# EAGLE schematic 96_Parallelism_Yamaichi_Rev1.2 (EAGLE 9.5.2)
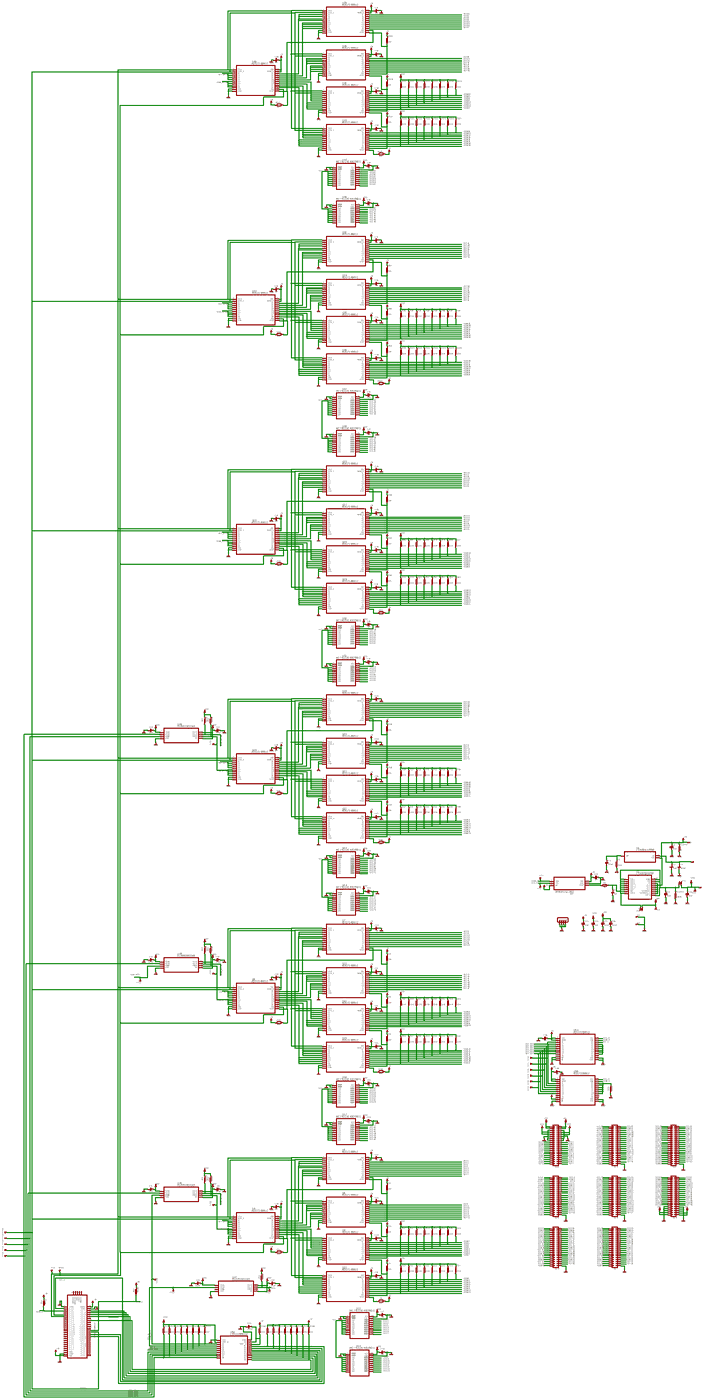
[diagram p0: schematic, sheet 1, overview]
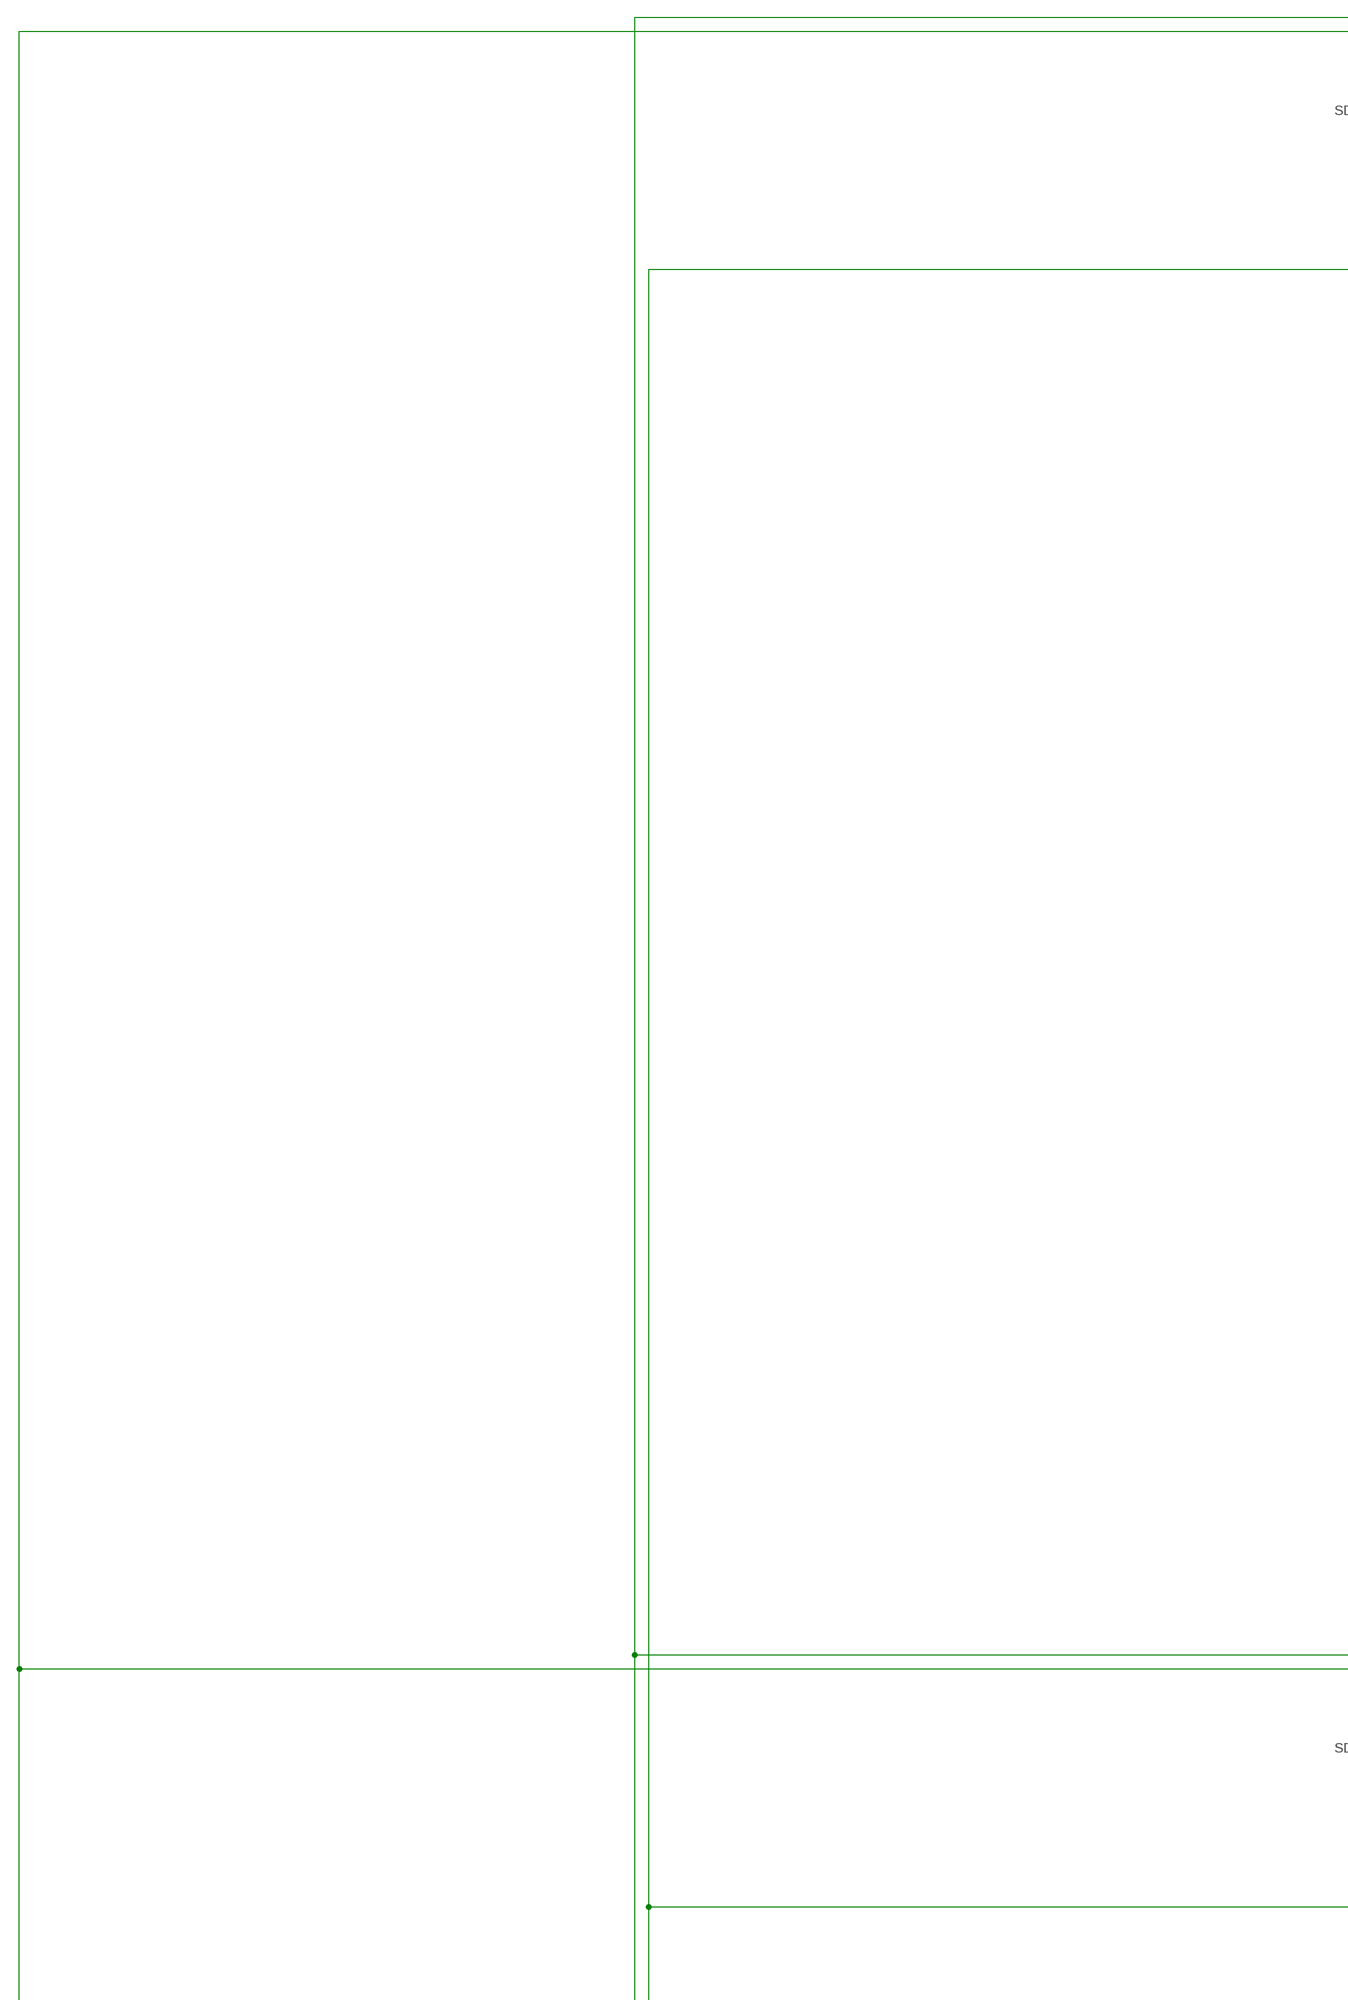
[diagram p1: schematic, sheet 1, part 1 of 8]
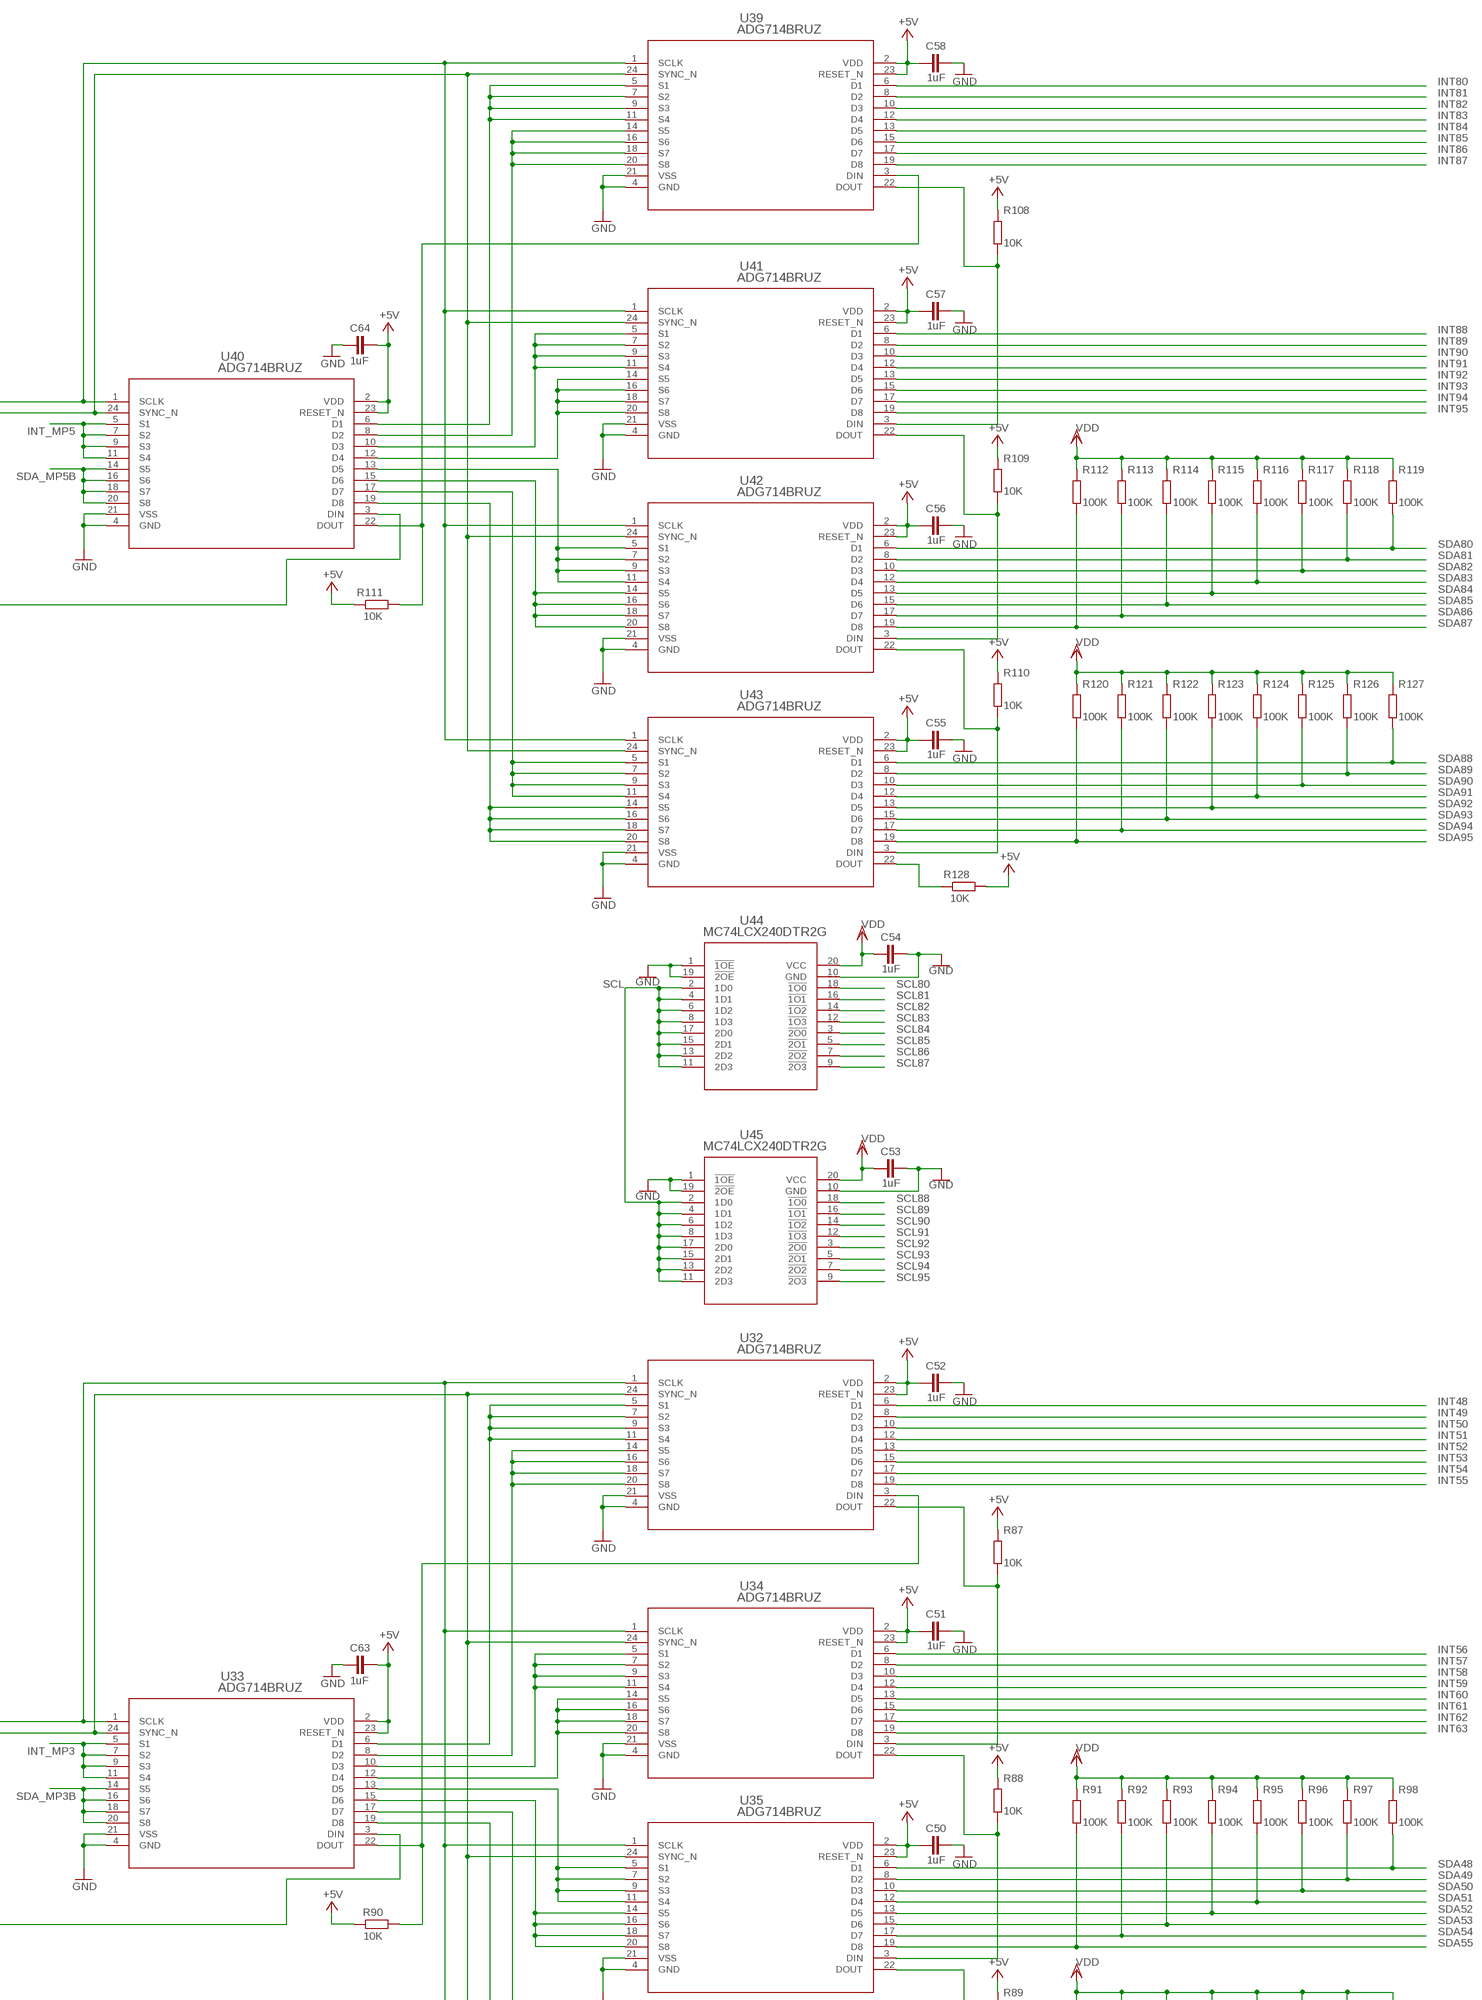
[diagram p2: schematic, sheet 1, part 2 of 8]
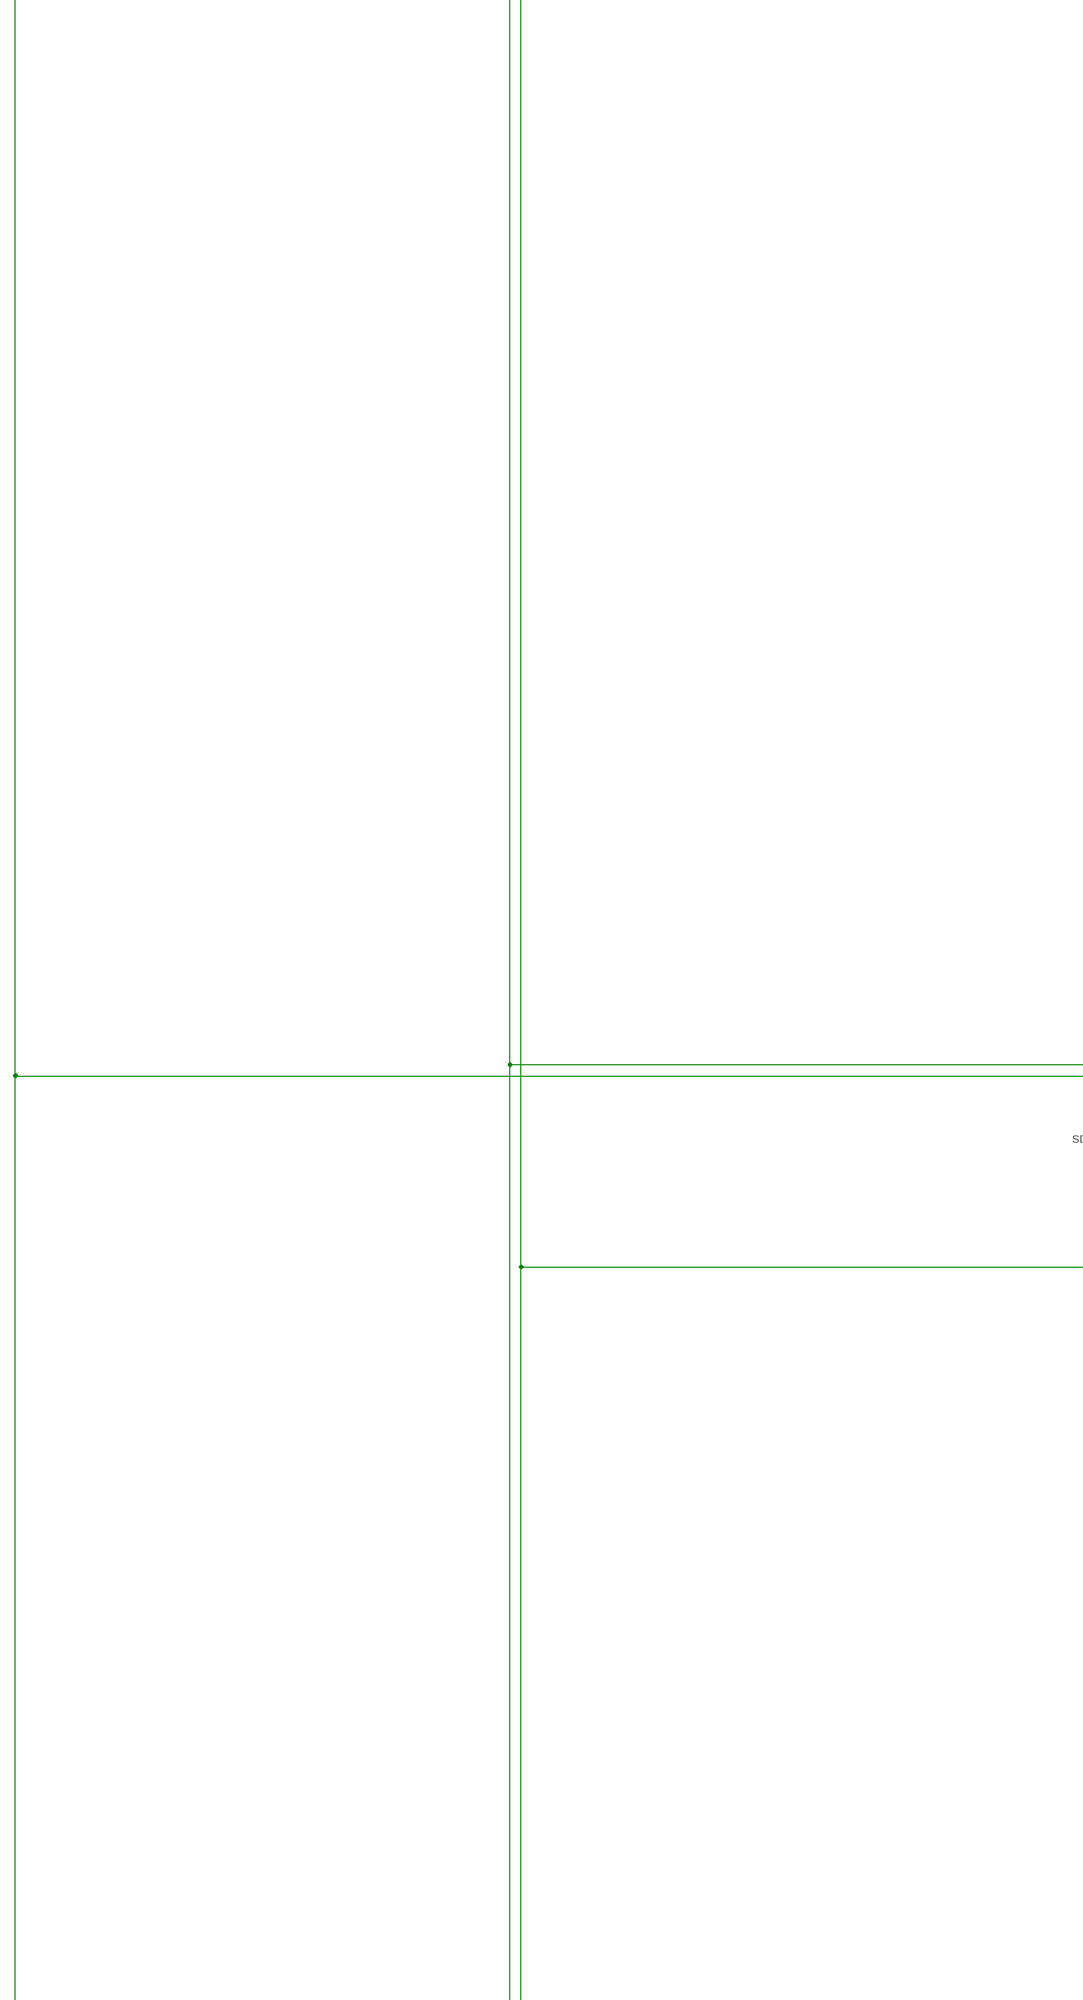
[diagram p3: schematic, sheet 1, part 3 of 8]
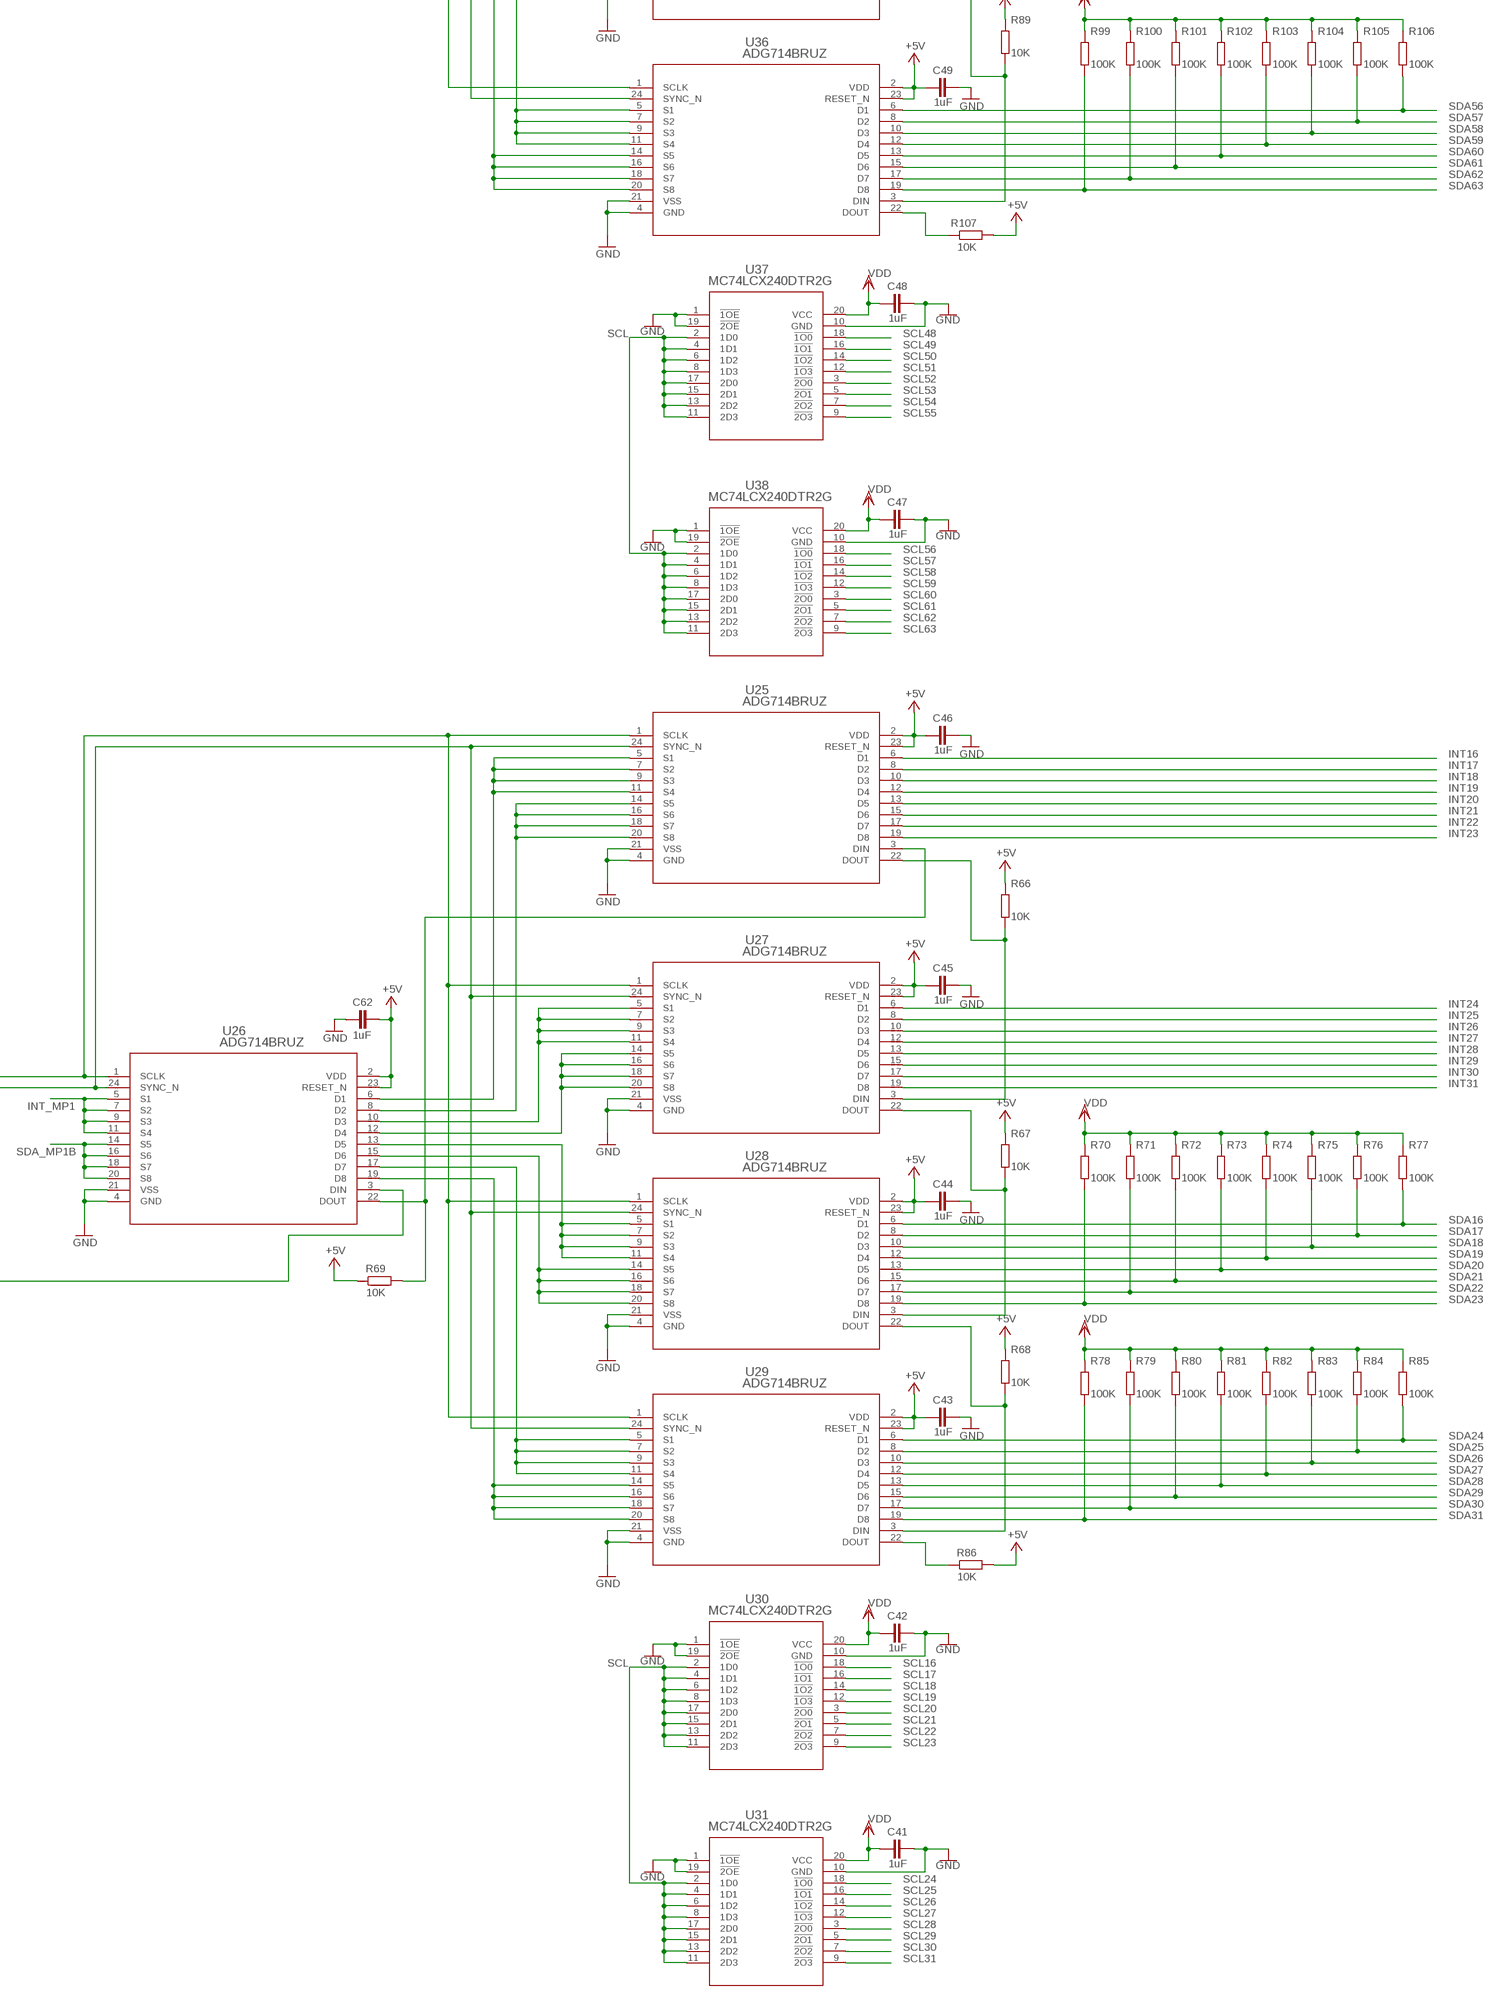
[diagram p4: schematic, sheet 1, part 4 of 8]
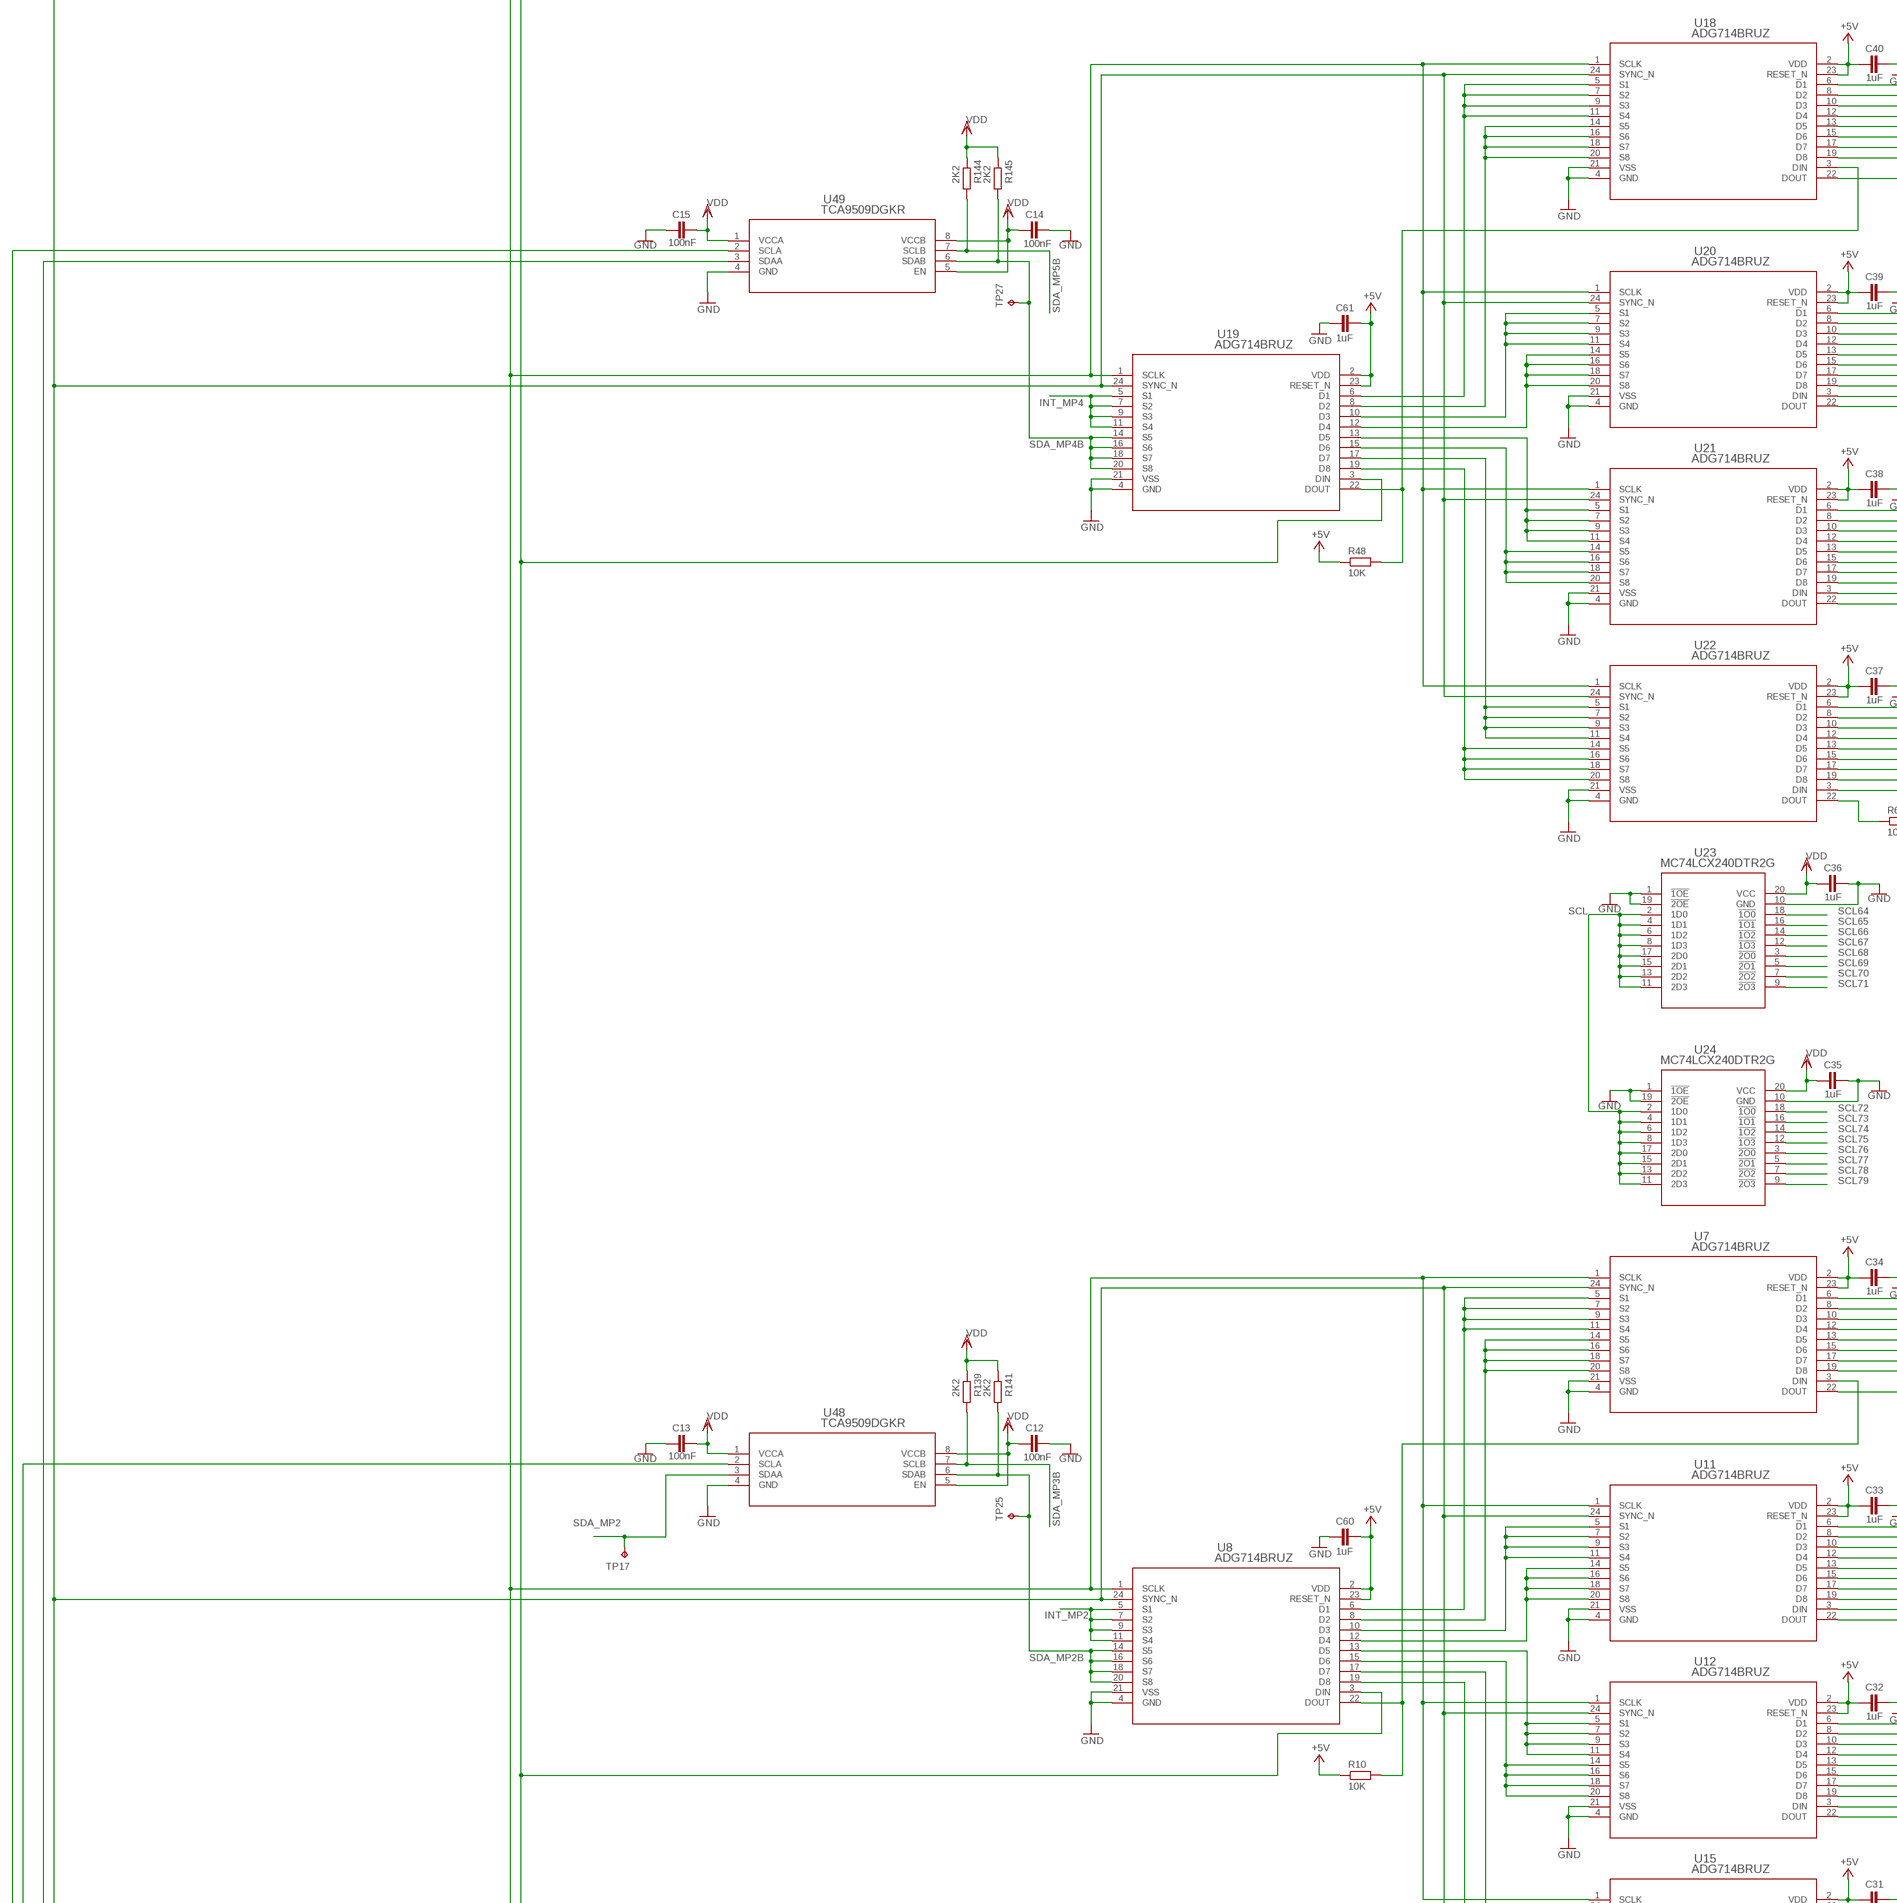
[diagram p5: schematic, sheet 1, part 5 of 8]
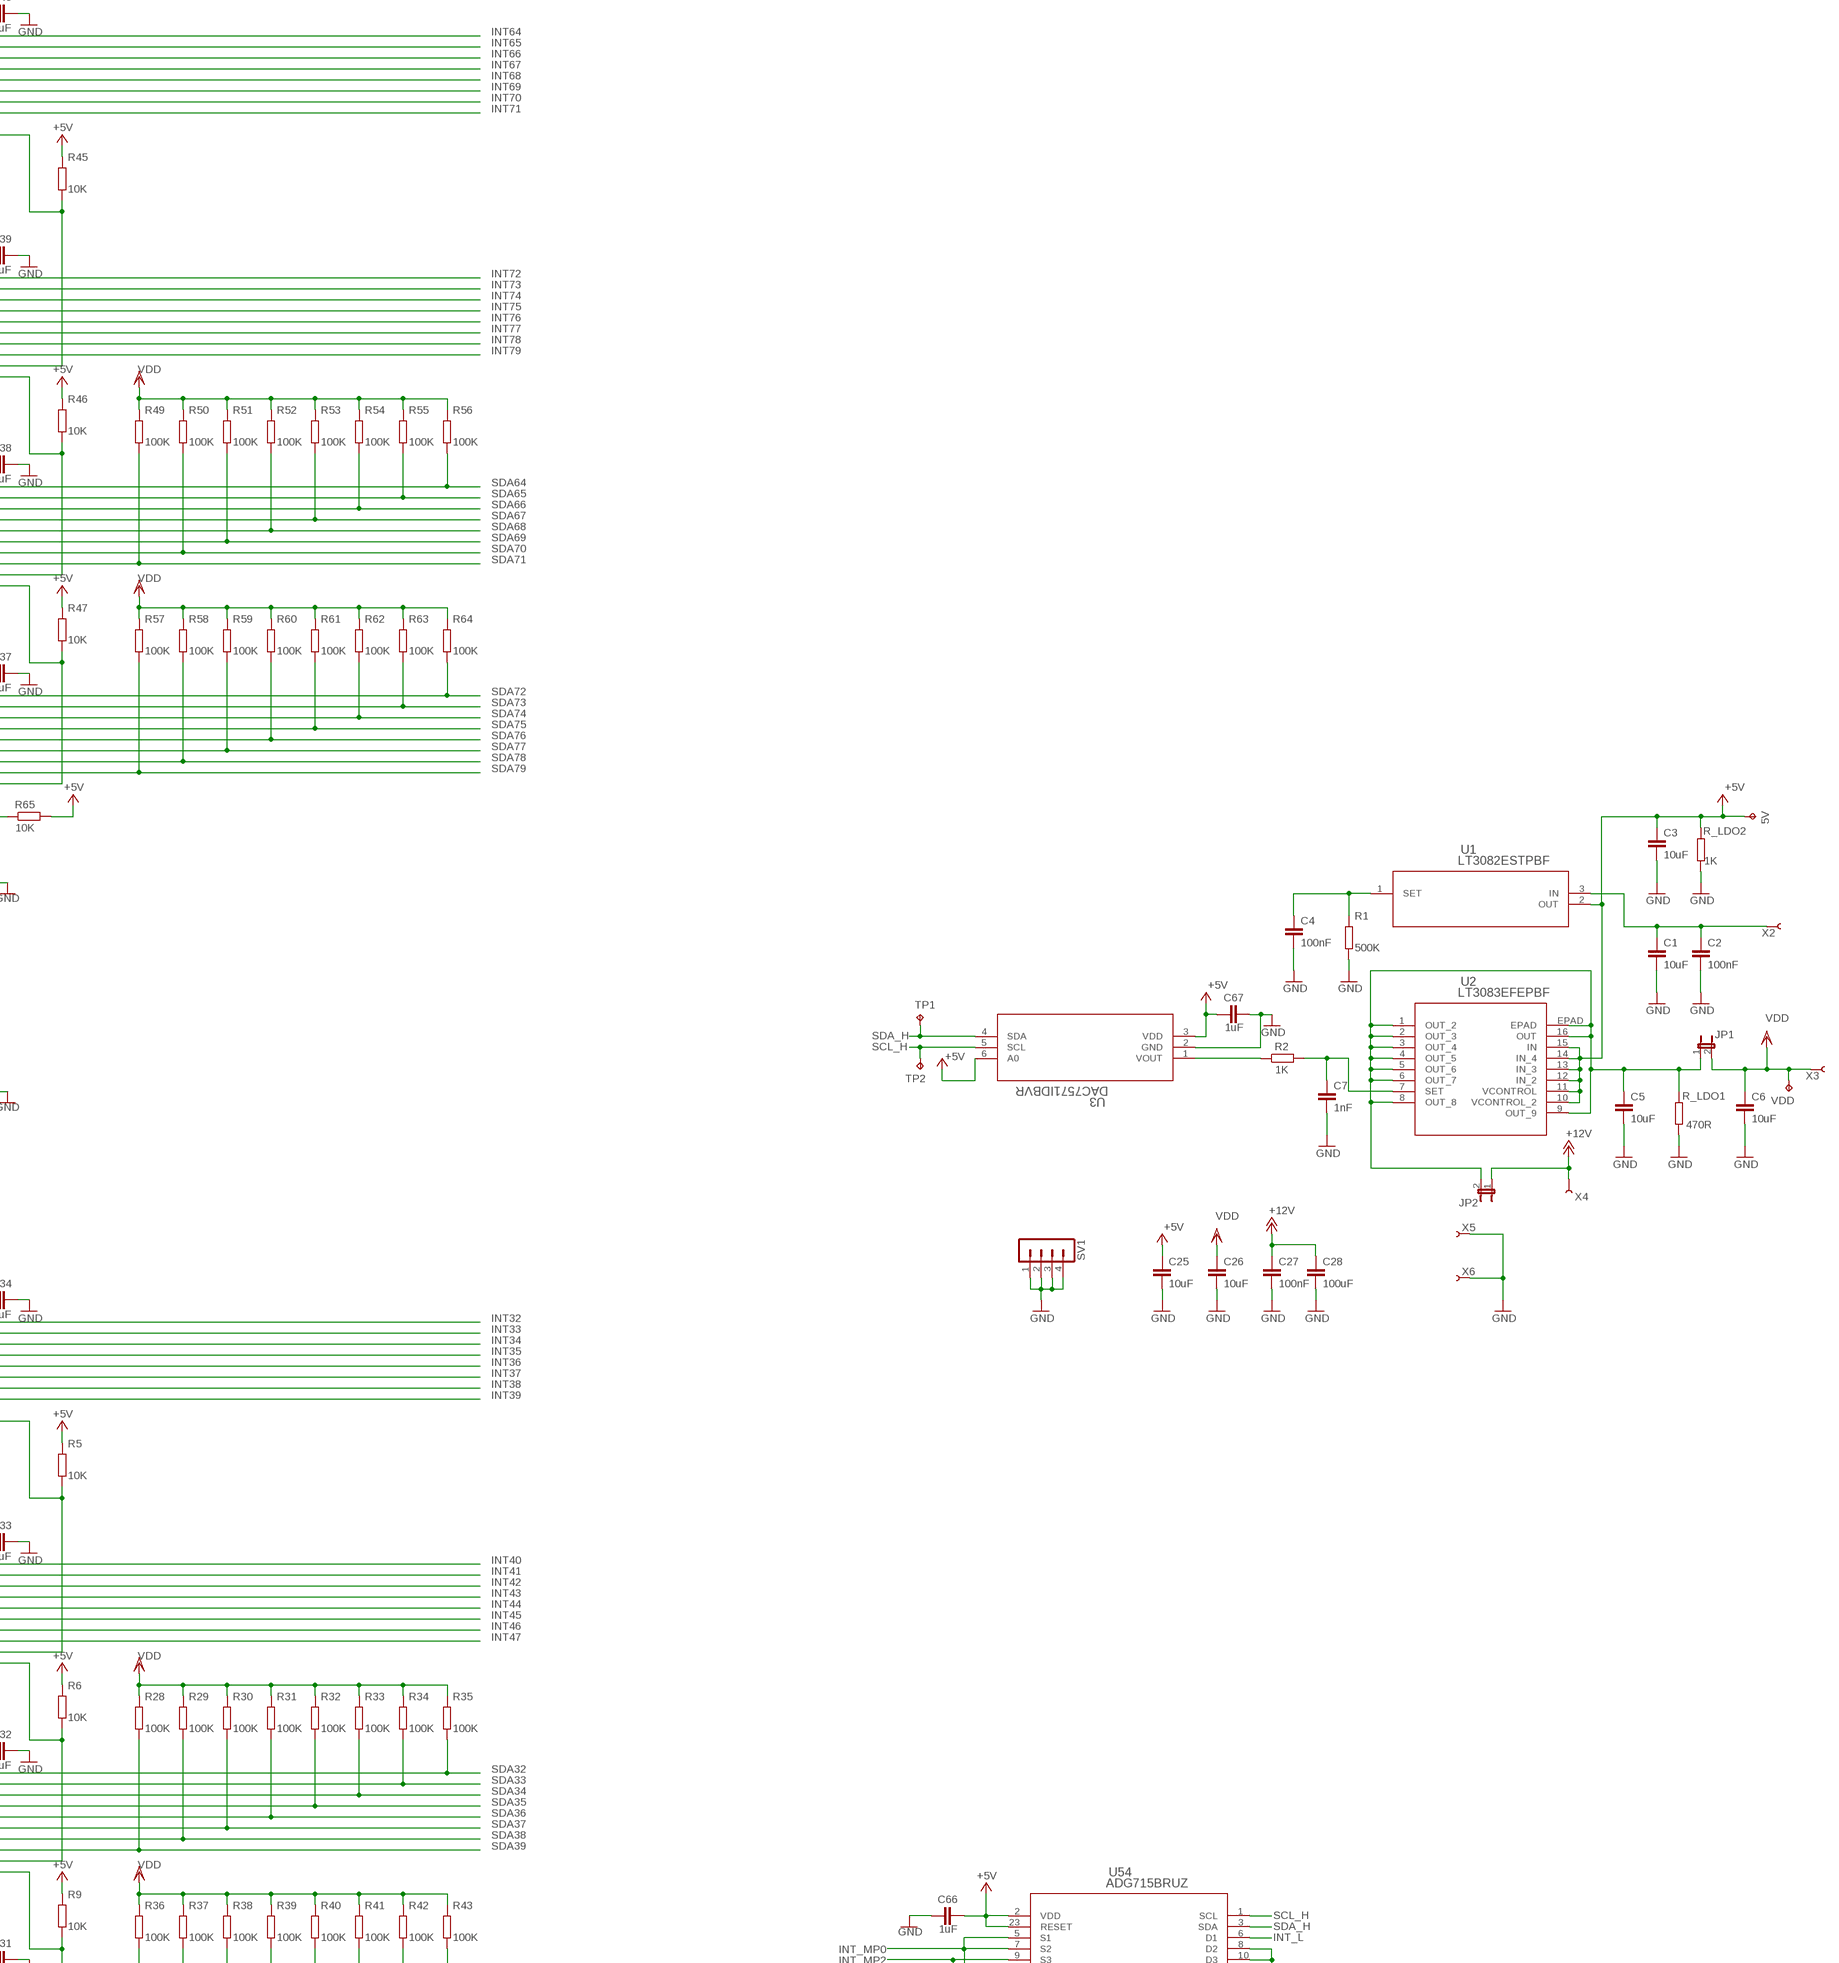
[diagram p6: schematic, sheet 1, part 6 of 8]
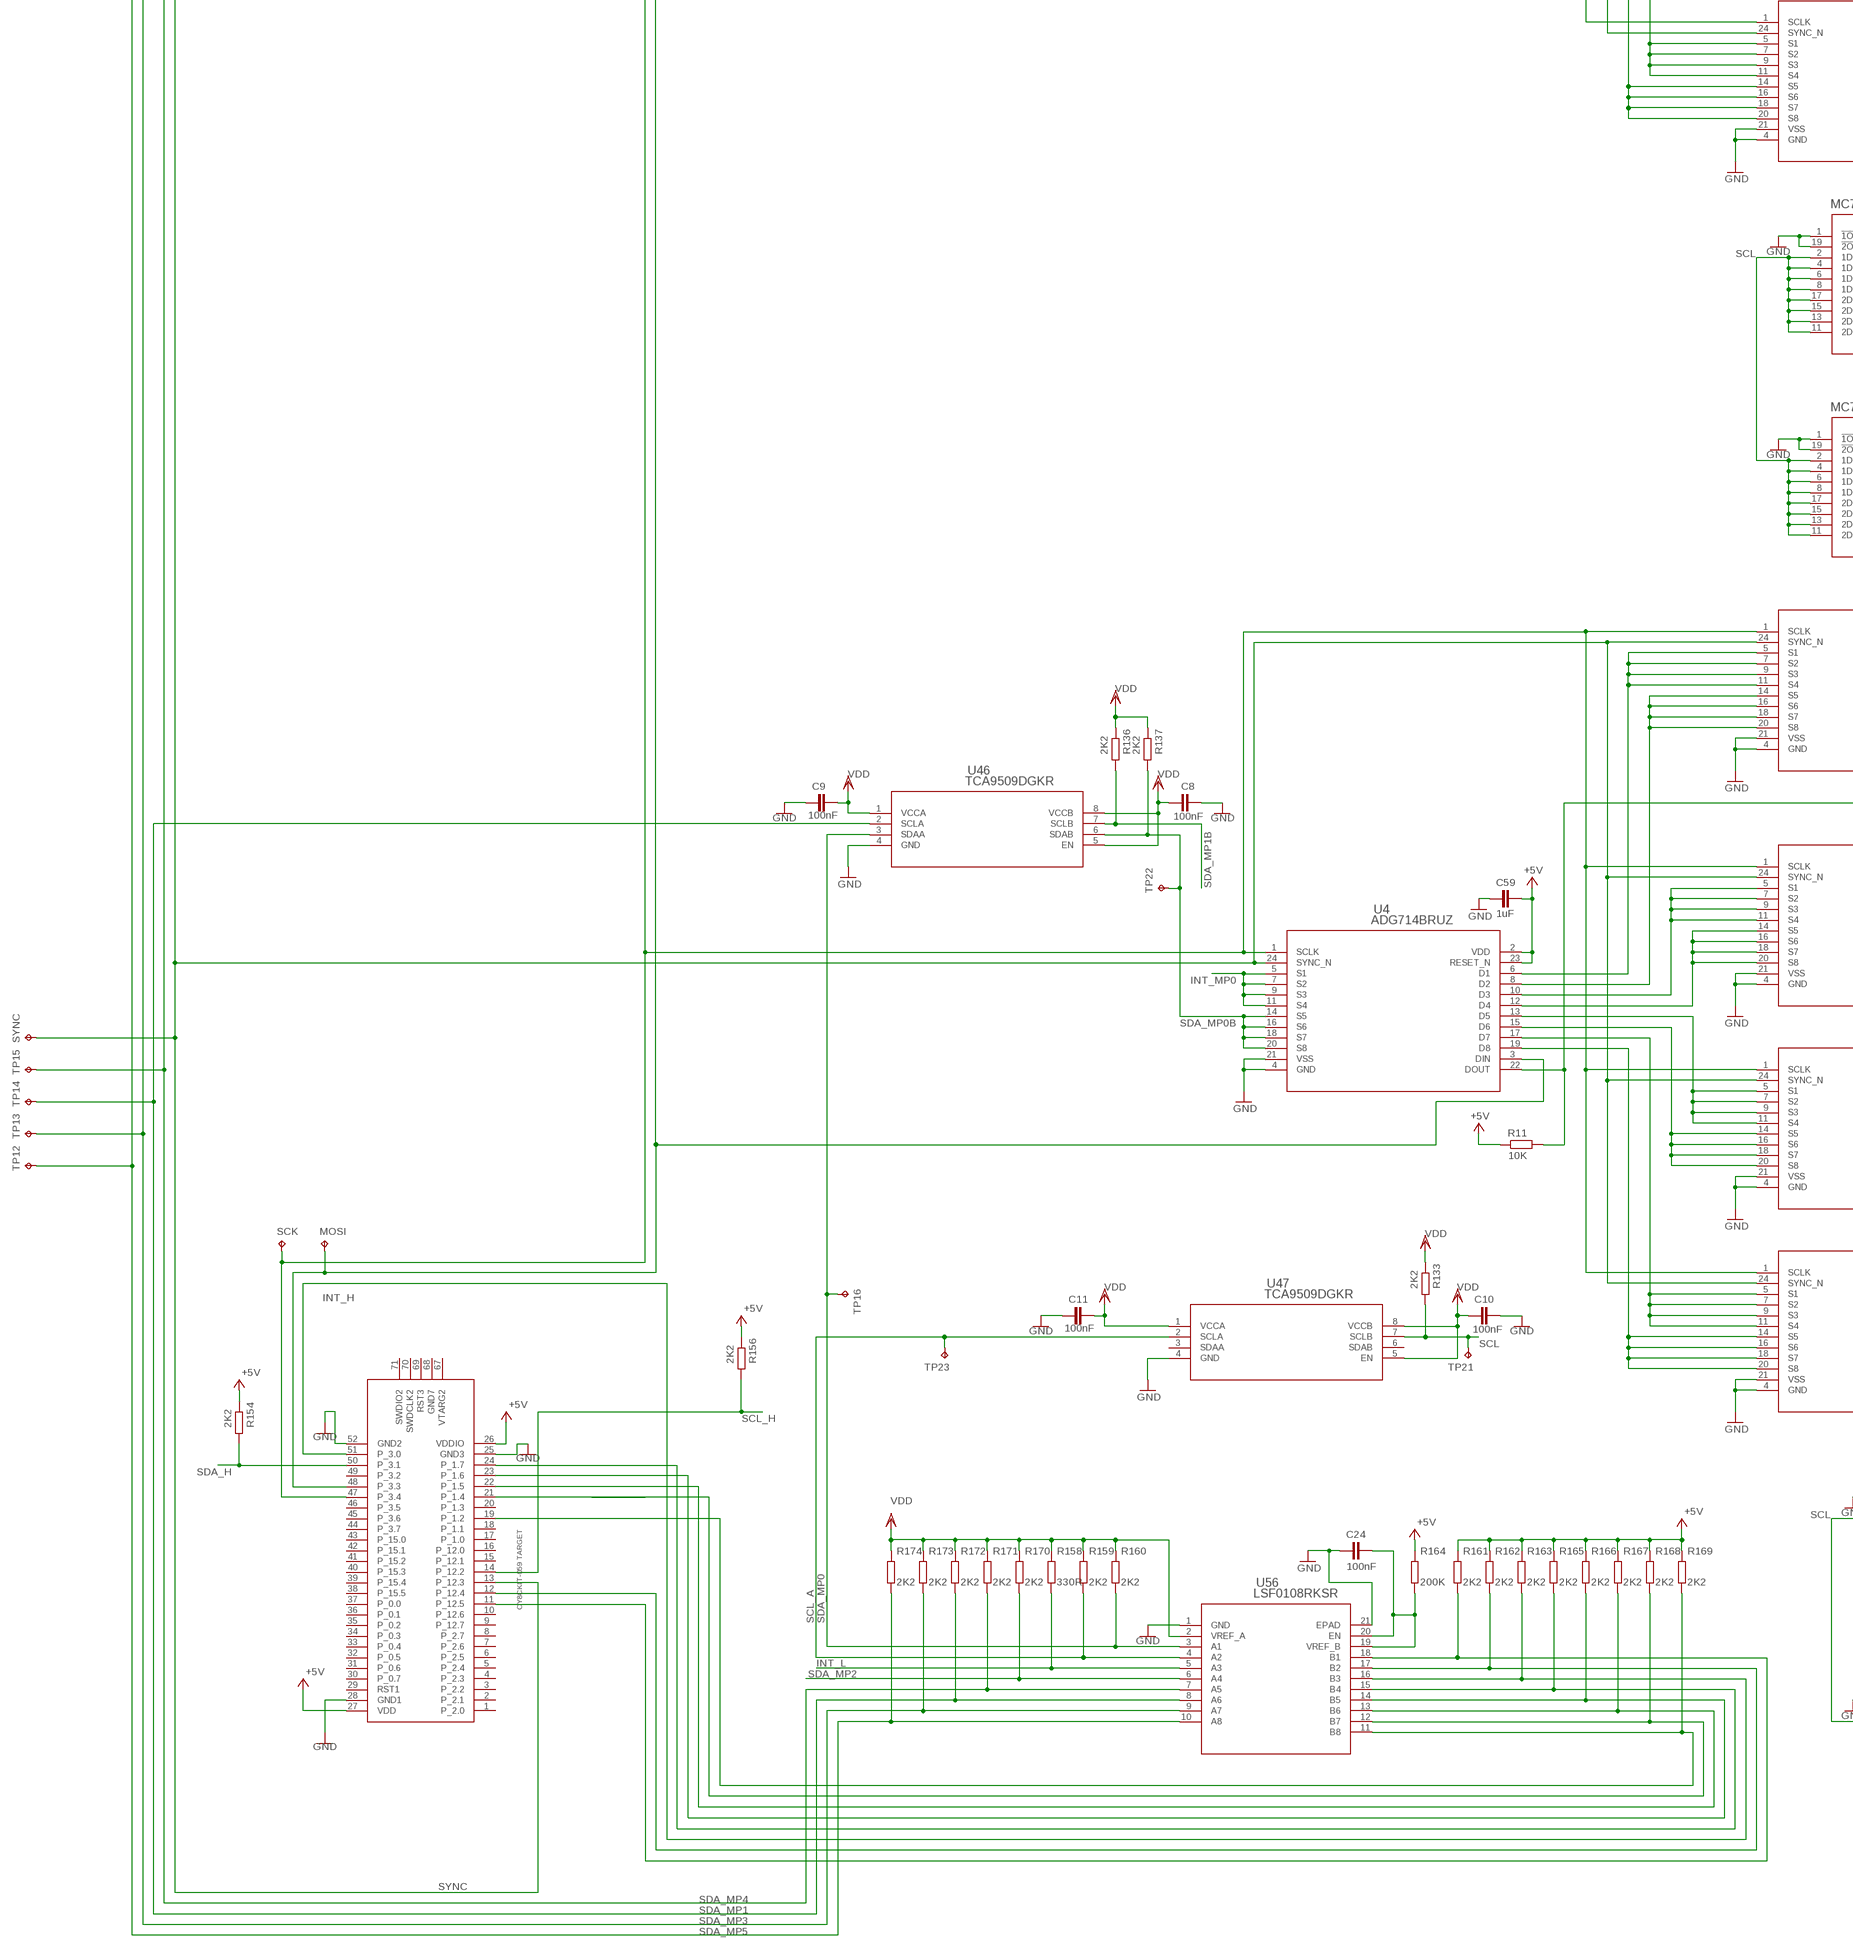
[diagram p7: schematic, sheet 1, part 7 of 8]
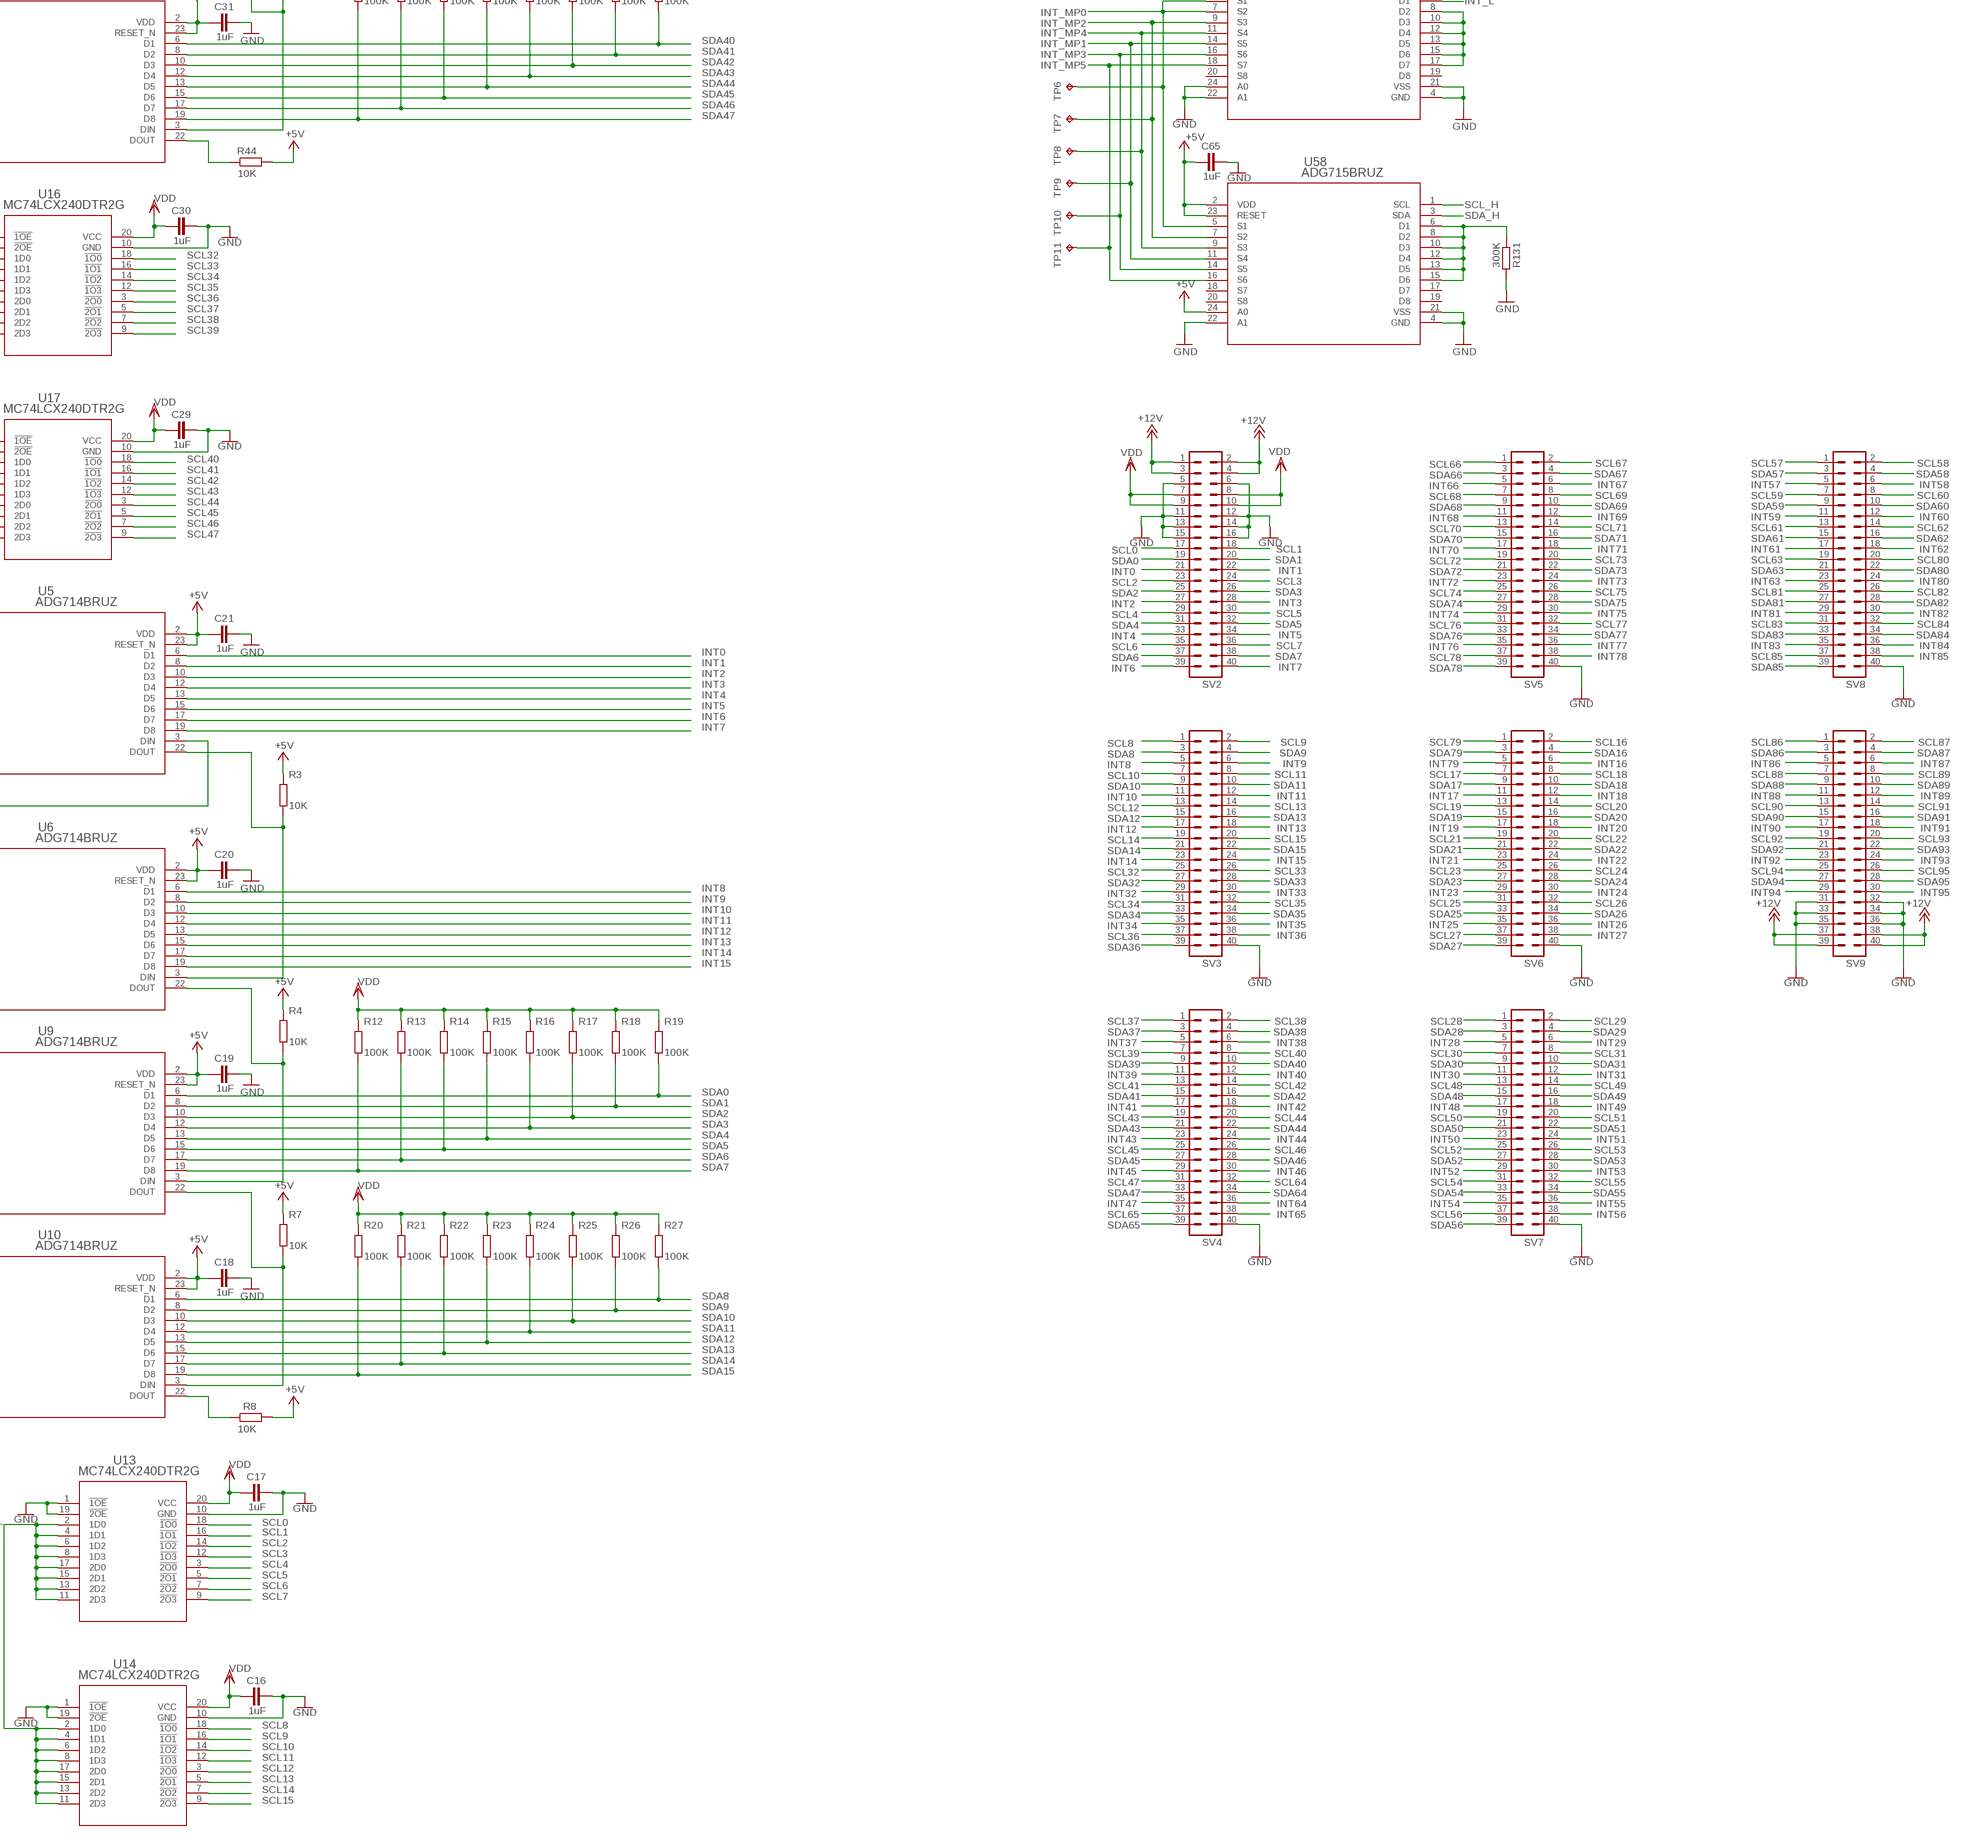
[diagram p8: schematic, sheet 1, part 8 of 8]

## Parts
5V  TPB1,27  [B1,27]
C1  10uF  C-EUC0805  [C0805]
C2  100nF  C-EUC0805  [C0805]
C3  10uF  C-EUC0805  [C0805]
C4  100nF  C-EUC0805  [C0805]
C5  10uF  C-EUC0805  [C0805]
C6  10uF  C-EUC0805  [C0805]
C7  1nF  C-EUC0805  [C0805]
C8  100nF  C-EUC0805  [C0805]
C9  100nF  C-EUC0805  [C0805]
C10  100nF  C-EUC0805  [C0805]
C11  100nF  C-EUC0805  [C0805]
C12  100nF  C-EUC0805  [C0805]
C13  100nF  C-EUC0805  [C0805]
C14  100nF  C-EUC0805  [C0805]
C15  100nF  C-EUC0805  [C0805]
C16  1uF  C-EUC0805  [C0805]
C17  1uF  C-EUC0805  [C0805]
C18  1uF  C-EUC0805  [C0805]
C19  1uF  C-EUC0805  [C0805]
C20  1uF  C-EUC0805  [C0805]
C21  1uF  C-EUC0805  [C0805]
C24  100nF  C-EUC0805  [C0805]
C25  10uF  C-EUC0805  [C0805]
C26  10uF  C-EUC0805  [C0805]
C27  100nF  C-EUC0805  [C0805]
C28  100uF  C-EUC1210  [C1210]
C29  1uF  C-EUC0805  [C0805]
C30  1uF  C-EUC0805  [C0805]
C31  1uF  C-EUC0805  [C0805]
C32  1uF  C-EUC0805  [C0805]
C33  1uF  C-EUC0805  [C0805]
C34  1uF  C-EUC0805  [C0805]
C35  1uF  C-EUC0805  [C0805]
C36  1uF  C-EUC0805  [C0805]
C37  1uF  C-EUC0805  [C0805]
C38  1uF  C-EUC0805  [C0805]
C39  1uF  C-EUC0805  [C0805]
C40  1uF  C-EUC0805  [C0805]
C41  1uF  C-EUC0805  [C0805]
C42  1uF  C-EUC0805  [C0805]
C43  1uF  C-EUC0805  [C0805]
C44  1uF  C-EUC0805  [C0805]
C45  1uF  C-EUC0805  [C0805]
C46  1uF  C-EUC0805  [C0805]
C47  1uF  C-EUC0805  [C0805]
C48  1uF  C-EUC0805  [C0805]
C49  1uF  C-EUC0805  [C0805]
C50  1uF  C-EUC0805  [C0805]
C51  1uF  C-EUC0805  [C0805]
C52  1uF  C-EUC0805  [C0805]
C53  1uF  C-EUC0805  [C0805]
C54  1uF  C-EUC0805  [C0805]
C55  1uF  C-EUC0805  [C0805]
C56  1uF  C-EUC0805  [C0805]
C57  1uF  C-EUC0805  [C0805]
C58  1uF  C-EUC0805  [C0805]
C59  1uF  C-EUC0805  [C0805]
C60  1uF  C-EUC0805  [C0805]
C61  1uF  C-EUC0805  [C0805]
C62  1uF  C-EUC0805  [C0805]
C63  1uF  C-EUC0805  [C0805]
C64  1uF  C-EUC0805  [C0805]
C65  1uF  C-EUC0805  [C0805]
C66  1uF  C-EUC0805  [C0805]
C67  1uF  C-EUC0805  [C0805]
JP1  JP1E  [JP1]
JP2  JP1E  [JP1]
MOSI  TPB1,27  [B1,27]
R1  500K  R-EU_R0805  [R0805]
R2  1K  R-EU_R0805  [R0805]
R3  10K  R-EU_R0805  [R0805]
R4  10K  R-EU_R0805  [R0805]
R5  10K  R-EU_R0805  [R0805]
R6  10K  R-EU_R0805  [R0805]
R7  10K  R-EU_R0805  [R0805]
R8  10K  R-EU_R0805  [R0805]
R9  10K  R-EU_R0805  [R0805]
R10  10K  R-EU_R0805  [R0805]
R11  10K  R-EU_R0805  [R0805]
R12  100K  R-EU_R0805  [R0805]
R13  100K  R-EU_R0805  [R0805]
R14  100K  R-EU_R0805  [R0805]
R15  100K  R-EU_R0805  [R0805]
R16  100K  R-EU_R0805  [R0805]
R17  100K  R-EU_R0805  [R0805]
R18  100K  R-EU_R0805  [R0805]
R19  100K  R-EU_R0805  [R0805]
R20  100K  R-EU_R0805  [R0805]
R21  100K  R-EU_R0805  [R0805]
R22  100K  R-EU_R0805  [R0805]
R23  100K  R-EU_R0805  [R0805]
R24  100K  R-EU_R0805  [R0805]
R25  100K  R-EU_R0805  [R0805]
R26  100K  R-EU_R0805  [R0805]
R27  100K  R-EU_R0805  [R0805]
R28  100K  R-EU_R0805  [R0805]
R29  100K  R-EU_R0805  [R0805]
R30  100K  R-EU_R0805  [R0805]
R31  100K  R-EU_R0805  [R0805]
R32  100K  R-EU_R0805  [R0805]
R33  100K  R-EU_R0805  [R0805]
R34  100K  R-EU_R0805  [R0805]
R35  100K  R-EU_R0805  [R0805]
R36  100K  R-EU_R0805  [R0805]
R37  100K  R-EU_R0805  [R0805]
R38  100K  R-EU_R0805  [R0805]
R39  100K  R-EU_R0805  [R0805]
R40  100K  R-EU_R0805  [R0805]
R41  100K  R-EU_R0805  [R0805]
R42  100K  R-EU_R0805  [R0805]
R43  100K  R-EU_R0805  [R0805]
R44  10K  R-EU_R0805  [R0805]
R45  10K  R-EU_R0805  [R0805]
R46  10K  R-EU_R0805  [R0805]
R47  10K  R-EU_R0805  [R0805]
R48  10K  R-EU_R0805  [R0805]
R49  100K  R-EU_R0805  [R0805]
R50  100K  R-EU_R0805  [R0805]
R51  100K  R-EU_R0805  [R0805]
R52  100K  R-EU_R0805  [R0805]
R53  100K  R-EU_R0805  [R0805]
R54  100K  R-EU_R0805  [R0805]
R55  100K  R-EU_R0805  [R0805]
R56  100K  R-EU_R0805  [R0805]
R57  100K  R-EU_R0805  [R0805]
R58  100K  R-EU_R0805  [R0805]
R59  100K  R-EU_R0805  [R0805]
R60  100K  R-EU_R0805  [R0805]
R61  100K  R-EU_R0805  [R0805]
R62  100K  R-EU_R0805  [R0805]
R63  100K  R-EU_R0805  [R0805]
R64  100K  R-EU_R0805  [R0805]
R65  10K  R-EU_R0805  [R0805]
R66  10K  R-EU_R0805  [R0805]
R67  10K  R-EU_R0805  [R0805]
R68  10K  R-EU_R0805  [R0805]
R69  10K  R-EU_R0805  [R0805]
R70  100K  R-EU_R0805  [R0805]
R71  100K  R-EU_R0805  [R0805]
R72  100K  R-EU_R0805  [R0805]
R73  100K  R-EU_R0805  [R0805]
R74  100K  R-EU_R0805  [R0805]
R75  100K  R-EU_R0805  [R0805]
R76  100K  R-EU_R0805  [R0805]
R77  100K  R-EU_R0805  [R0805]
R78  100K  R-EU_R0805  [R0805]
R79  100K  R-EU_R0805  [R0805]
R80  100K  R-EU_R0805  [R0805]
R81  100K  R-EU_R0805  [R0805]
R82  100K  R-EU_R0805  [R0805]
R83  100K  R-EU_R0805  [R0805]
R84  100K  R-EU_R0805  [R0805]
R85  100K  R-EU_R0805  [R0805]
R86  10K  R-EU_R0805  [R0805]
R87  10K  R-EU_R0805  [R0805]
R88  10K  R-EU_R0805  [R0805]
R89  10K  R-EU_R0805  [R0805]
R90  10K  R-EU_R0805  [R0805]
R91  100K  R-EU_R0805  [R0805]
R92  100K  R-EU_R0805  [R0805]
R93  100K  R-EU_R0805  [R0805]
R94  100K  R-EU_R0805  [R0805]
R95  100K  R-EU_R0805  [R0805]
R96  100K  R-EU_R0805  [R0805]
R97  100K  R-EU_R0805  [R0805]
R98  100K  R-EU_R0805  [R0805]
R99  100K  R-EU_R0805  [R0805]
R100  100K  R-EU_R0805  [R0805]
R101  100K  R-EU_R0805  [R0805]
R102  100K  R-EU_R0805  [R0805]
R103  100K  R-EU_R0805  [R0805]
R104  100K  R-EU_R0805  [R0805]
R105  100K  R-EU_R0805  [R0805]
R106  100K  R-EU_R0805  [R0805]
R107  10K  R-EU_R0805  [R0805]
R108  10K  R-EU_R0805  [R0805]
R109  10K  R-EU_R0805  [R0805]
R110  10K  R-EU_R0805  [R0805]
R111  10K  R-EU_R0805  [R0805]
R112  100K  R-EU_R0805  [R0805]
R113  100K  R-EU_R0805  [R0805]
R114  100K  R-EU_R0805  [R0805]
R115  100K  R-EU_R0805  [R0805]
R116  100K  R-EU_R0805  [R0805]
R117  100K  R-EU_R0805  [R0805]
R118  100K  R-EU_R0805  [R0805]
R119  100K  R-EU_R0805  [R0805]
R120  100K  R-EU_R0805  [R0805]
R121  100K  R-EU_R0805  [R0805]
R122  100K  R-EU_R0805  [R0805]
R123  100K  R-EU_R0805  [R0805]
R124  100K  R-EU_R0805  [R0805]
R125  100K  R-EU_R0805  [R0805]
R126  100K  R-EU_R0805  [R0805]
R127  100K  R-EU_R0805  [R0805]
R128  10K  R-EU_R0805  [R0805]
R131  300K  R-EU_R0805  [R0805]
R133  2K2  R-EU_R0805  [R0805]
R136  2K2  R-EU_R0805  [R0805]
R137  2K2  R-EU_R0805  [R0805]
R139  2K2  R-EU_R0805  [R0805]
R141  2K2  R-EU_R0805  [R0805]
R144  2K2  R-EU_R0805  [R0805]
R145  2K2  R-EU_R0805  [R0805]
R154  2K2  R-EU_R0805  [R0805]
R156  2K2  R-EU_R0805  [R0805]
R158  330R  R-EU_R0805  [R0805]
R159  2K2  R-EU_R0805  [R0805]
R160  2K2  R-EU_R0805  [R0805]
R161  2K2  R-EU_R0805  [R0805]
R162  2K2  R-EU_R0805  [R0805]
R163  2K2  R-EU_R0805  [R0805]
R164  200K  R-EU_R0805  [R0805]
R165  2K2  R-EU_R0805  [R0805]
R166  2K2  R-EU_R0805  [R0805]
R167  2K2  R-EU_R0805  [R0805]
R168  2K2  R-EU_R0805  [R0805]
R169  2K2  R-EU_R0805  [R0805]
R170  2K2  R-EU_R0805  [R0805]
R171  2K2  R-EU_R0805  [R0805]
R172  2K2  R-EU_R0805  [R0805]
R173  2K2  R-EU_R0805  [R0805]
R174  2K2  R-EU_R0805  [R0805]
R_LDO1  470R  R-EU_R0805  [R0805]
R_LDO2  1K  R-EU_R0805  [R0805]
SCK  TPB1,27  [B1,27]
SV1  MA04-1  [MA04-1]
SV2  MA20-2  [MA20-2]
SV3  MA20-2  [MA20-2]
SV4  MA20-2  [MA20-2]
SV5  MA20-2  [MA20-2]
SV6  MA20-2  [MA20-2]
SV7  MA20-2  [MA20-2]
SV8  MA20-2  [MA20-2]
SV9  MA20-2  [MA20-2]
SYNC  TPB1,27  [B1,27]
TP1  TPB1,27  [B1,27]
TP2  TPB1,27  [B1,27]
TP6  TPB1,27  [B1,27]
TP7  TPB1,27  [B1,27]
TP8  TPB1,27  [B1,27]
TP9  TPB1,27  [B1,27]
TP10  TPB1,27  [B1,27]
TP11  TPB1,27  [B1,27]
TP12  TPB1,27  [B1,27]
TP13  TPB1,27  [B1,27]
TP14  TPB1,27  [B1,27]
TP15  TPB1,27  [B1,27]
TP16  TPB1,27  [B1,27]
TP17  TPB1,27  [B1,27]
TP21  TPB1,27  [B1,27]
TP22  TPB1,27  [B1,27]
TP23  TPB1,27  [B1,27]
TP25  TPB1,27  [B1,27]
TP27  TPB1,27  [B1,27]
U1  LT3082ESTPBF  [SOT-223_ST_LIT]
U2  LT3083EFEPBF  [TSSOP-16_FE/BB_LIT]
U3  DAC7571IDBVR  [DBV6]
U4  ADG714BRUZ  [RU_24_ADI]
U5  ADG714BRUZ  [RU_24_ADI]
U6  ADG714BRUZ  [RU_24_ADI]
U7  ADG714BRUZ  [RU_24_ADI]
U8  ADG714BRUZ  [RU_24_ADI]
U9  ADG714BRUZ  [RU_24_ADI]
U10  ADG714BRUZ  [RU_24_ADI]
U11  ADG714BRUZ  [RU_24_ADI]
U12  ADG714BRUZ  [RU_24_ADI]
U13  MC74LCX240DTR2G  [TSSOP20_4P50X6P60_ONS]
U14  MC74LCX240DTR2G  [TSSOP20_4P50X6P60_ONS]
U15  ADG714BRUZ  [RU_24_ADI]
U16  MC74LCX240DTR2G  [TSSOP20_4P50X6P60_ONS]
U17  MC74LCX240DTR2G  [TSSOP20_4P50X6P60_ONS]
U18  ADG714BRUZ  [RU_24_ADI]
U19  ADG714BRUZ  [RU_24_ADI]
U20  ADG714BRUZ  [RU_24_ADI]
U21  ADG714BRUZ  [RU_24_ADI]
U22  ADG714BRUZ  [RU_24_ADI]
U23  MC74LCX240DTR2G  [TSSOP20_4P50X6P60_ONS]
U24  MC74LCX240DTR2G  [TSSOP20_4P50X6P60_ONS]
U25  ADG714BRUZ  [RU_24_ADI]
U26  ADG714BRUZ  [RU_24_ADI]
U27  ADG714BRUZ  [RU_24_ADI]
U28  ADG714BRUZ  [RU_24_ADI]
U29  ADG714BRUZ  [RU_24_ADI]
U30  MC74LCX240DTR2G  [TSSOP20_4P50X6P60_ONS]
U31  MC74LCX240DTR2G  [TSSOP20_4P50X6P60_ONS]
U32  ADG714BRUZ  [RU_24_ADI]
U33  ADG714BRUZ  [RU_24_ADI]
U34  ADG714BRUZ  [RU_24_ADI]
U35  ADG714BRUZ  [RU_24_ADI]
U36  ADG714BRUZ  [RU_24_ADI]
U37  MC74LCX240DTR2G  [TSSOP20_4P50X6P60_ONS]
U38  MC74LCX240DTR2G  [TSSOP20_4P50X6P60_ONS]
U39  ADG714BRUZ  [RU_24_ADI]
U40  ADG714BRUZ  [RU_24_ADI]
U41  ADG714BRUZ  [RU_24_ADI]
U42  ADG714BRUZ  [RU_24_ADI]
U43  ADG714BRUZ  [RU_24_ADI]
U44  MC74LCX240DTR2G  [TSSOP20_4P50X6P60_ONS]
U45  MC74LCX240DTR2G  [TSSOP20_4P50X6P60_ONS]
U46  TCA9509DGKR  [DGK8]
U47  TCA9509DGKR  [DGK8]
U48  TCA9509DGKR  [DGK8]
U49  TCA9509DGKR  [DGK8]
U54  ADG715BRUZ  [RU_24_ADI]
U56  LSF0108RKSR  [RKS20_1P1X3P1_TEX]
U58  ADG715BRUZ  [RU_24_ADI]
U$1  CY8CKIT-059_TARGET  [CY8CKIT-059_TARGET]
VDD  TPB1,27  [B1,27]
X2  MPB2M  [MPB2M]
X3  MPB2M  [MPB2M]
X4  MPB2M  [MPB2M]
X5  MPB2M  [MPB2M]
X6  MPB2M  [MPB2M]

## Nets
+5V: 5V.TP C3.1 C18.1 C19.1 C20.1 C21.1 C25.1 C31.1 C32.1 C33.1 C34.1 C37.1 C38.1 C39.1 C40.1 C43.1 C44.1 C45.1 C46.1 C49.1 C50.1 C51.1 C52.1 C55.1 C56.1 C57.1 C58.1 C59.1 C60.1 C61.1 C62.1 C63.1 C64.1 C65.1 C66.1 C67.2 R3.1 R4.1 R5.1 R6.1 R7.1 R8.2 R9.1 R10.1 R11.1 R44.2 R45.1 R46.1 R47.1 R48.1 R65.2 R66.1 R67.1 R68.1 R69.1 R86.2 R87.1 R88.1 R89.1 R90.1 R107.2 R108.1 R109.1 R110.1 R111.1 R128.2 R154.1 R156.1 R161.1 R162.1 R163.1 R164.1 R165.1 R166.1 R167.1 R168.1 R169.1 R_LDO2.1 U1.2(OUT) U2.10(VCONTROL_2) U2.11(VCONTROL) U2.12(IN_2) U2.13(IN_3) U2.14(IN_4) U2.15(IN) U3.3(VDD) U3.6(A0) U4.2(VDD) U4.23(RESET_N) U5.2(VDD) U5.23(RESET_N) U6.2(VDD) U6.23(RESET_N) U7.2(VDD) U7.23(RESET_N) U8.2(VDD) U8.23(RESET_N) U9.2(VDD) U9.23(RESET_N) U10.2(VDD) U10.23(RESET_N) U11.2(VDD) U11.23(RESET_N) U12.2(VDD) U12.23(RESET_N) U15.2(VDD) U15.23(RESET_N) U18.2(VDD) U18.23(RESET_N) U19.2(VDD) U19.23(RESET_N) U20.2(VDD) U20.23(RESET_N) U21.2(VDD) U21.23(RESET_N) U22.2(VDD) U22.23(RESET_N) U25.2(VDD) U25.23(RESET_N) U26.2(VDD) U26.23(RESET_N) U27.2(VDD) U27.23(RESET_N) U28.2(VDD) U28.23(RESET_N) U29.2(VDD) U29.23(RESET_N) U32.2(VDD) U32.23(RESET_N) U33.2(VDD) U33.23(RESET_N) U34.2(VDD) U34.23(RESET_N) U35.2(VDD) U35.23(RESET_N) U36.2(VDD) U36.23(RESET_N) U39.2(VDD) U39.23(RESET_N) U40.2(VDD) U40.23(RESET_N) U41.2(VDD) U41.23(RESET_N) U42.2(VDD) U42.23(RESET_N) U43.2(VDD) U43.23(RESET_N) U54.2(VDD) U54.23(RESET) U58.2(VDD) U58.23(RESET) U58.24(A0) U$1.26(VDDIO) U$1.27(VDD)
+12V: C27.1 C28.1 JP2.1 SV2.1 SV2.2 SV2.3 SV2.4 SV9.37 SV9.38 SV9.39 SV9.40 X4.1 X4.1@1
GND: C1.2 C2.2 C3.2 C4.2 C5.2 C6.2 C7.2 C8.2 C9.2 C10.2 C11.2 C12.2 C13.2 C14.2 C15.2 C16.2 C17.2 C18.2 C19.2 C20.2 C21.2 C24.1 C25.2 C26.2 C27.2 C28.2 C29.2 C30.2 C31.2 C32.2 C33.2 C34.2 C35.2 C36.2 C37.2 C38.2 C39.2 C40.2 C41.2 C42.2 C43.2 C44.2 C45.2 C46.2 C47.2 C48.2 C49.2 C50.2 C51.2 C52.2 C53.2 C54.2 C55.2 C56.2 C57.2 C58.2 C59.2 C60.2 C61.2 C62.2 C63.2 C64.2 C65.2 C66.2 C67.1 R1.2 R131.1 R_LDO1.2 R_LDO2.2 SV1.1 SV1.2 SV1.3 SV1.4 SV2.5 SV2.6 SV2.11 SV2.12 SV2.13 SV2.14 SV2.15 SV2.16 SV3.40 SV4.40 SV5.40 SV6.40 SV7.40 SV8.40 SV9.31 SV9.32 SV9.33 SV9.34 SV9.35 SV9.36 U3.2(GND) U4.4(GND) U4.21(VSS) U5.4(GND) U5.21(VSS) U6.4(GND) U6.21(VSS) U7.4(GND) U7.21(VSS) U8.4(GND) U8.21(VSS) U9.4(GND) U9.21(VSS) U10.4(GND) U10.21(VSS) U11.4(GND) U11.21(VSS) U12.4(GND) U12.21(VSS) U13.1(!1OE) U13.10(GND) U13.19(!2OE) U14.1(!1OE) U14.10(GND) U14.19(!2OE) U15.4(GND) U15.21(VSS) U16.1(!1OE) U16.10(GND) U16.19(!2OE) U17.1(!1OE) U17.10(GND) U17.19(!2OE) U18.4(GND) U18.21(VSS) U19.4(GND) U19.21(VSS) U20.4(GND) U20.21(VSS) U21.4(GND) U21.21(VSS) U22.4(GND) U22.21(VSS) U23.1(!1OE) U23.10(GND) U23.19(!2OE) U24.1(!1OE) U24.10(GND) U24.19(!2OE) U25.4(GND) U25.21(VSS) U26.4(GND) U26.21(VSS) U27.4(GND) U27.21(VSS) U28.4(GND) U28.21(VSS) U29.4(GND) U29.21(VSS) U30.1(!1OE) U30.10(GND) U30.19(!2OE) U31.1(!1OE) U31.10(GND) U31.19(!2OE) U32.4(GND) U32.21(VSS) U33.4(GND) U33.21(VSS) U34.4(GND) U34.21(VSS) U35.4(GND) U35.21(VSS) U36.4(GND) U36.21(VSS) U37.1(!1OE) U37.10(GND) U37.19(!2OE) U38.1(!1OE) U38.10(GND) U38.19(!2OE) U39.4(GND) U39.21(VSS) U40.4(GND) U40.21(VSS) U41.4(GND) U41.21(VSS) U42.4(GND) U42.21(VSS) U43.4(GND) U43.21(VSS) U44.1(!1OE) U44.10(GND) U44.19(!2OE) U45.1(!1OE) U45.10(GND) U45.19(!2OE) U46.4(GND) U47.4(GND) U48.4(GND) U49.4(GND) U54.4(GND) U54.21(VSS) U54.22(A1) U54.24(A0) U56.1(GND) U56.21(EPAD) U58.4(GND) U58.21(VSS) U58.22(A1) U$1.25(GND3) U$1.28(GND1) U$1.52(GND2) X5.1 X5.1@1 X6.1 X6.1@1
INT0: SV2.21 U5.6(D1)
INT1: SV2.22 U5.8(D2)
INT2: SV2.27 U5.10(D3)
INT3: SV2.28 U5.12(D4)
INT4: SV2.33 U5.13(D5)
INT5: SV2.34 U5.15(D6)
INT6: SV2.39 U5.17(D7)
INT7: SV2.40 U5.19(D8)
INT8: SV3.5 U6.6(D1)
INT9: SV3.6 U6.8(D2)
INT10: SV3.11 U6.10(D3)
INT11: SV3.12 U6.12(D4)
INT12: SV3.17 U6.13(D5)
INT13: SV3.18 U6.15(D6)
INT14: SV3.23 U6.17(D7)
INT15: SV3.24 U6.19(D8)
INT16: SV6.6 U25.6(D1)
INT17: SV6.11 U25.8(D2)
INT18: SV6.12 U25.10(D3)
INT19: SV6.17 U25.12(D4)
INT20: SV6.18 U25.13(D5)
INT21: SV6.23 U25.15(D6)
INT22: SV6.24 U25.17(D7)
INT23: SV6.29 U25.19(D8)
INT24: SV6.30 U27.6(D1)
INT25: SV6.35 U27.8(D2)
INT26: SV6.36 U27.10(D3)
INT27: SV6.38 U27.12(D4)
INT28: SV7.5 U27.13(D5)
INT29: SV7.6 U27.15(D6)
INT30: SV7.11 U27.17(D7)
INT31: SV7.12 U27.19(D8)
INT32: SV3.29 U7.6(D1)
INT33: SV3.30 U7.8(D2)
INT34: SV3.35 U7.10(D3)
INT35: SV3.36 U7.12(D4)
INT36: SV3.38 U7.13(D5)
INT37: SV4.5 U7.15(D6)
INT38: SV4.6 U7.17(D7)
INT39: SV4.11 U7.19(D8)
INT40: SV4.12 U11.6(D1)
INT41: SV4.17 U11.8(D2)
INT42: SV4.18 U11.10(D3)
INT43: SV4.23 U11.12(D4)
INT44: SV4.24 U11.13(D5)
INT45: SV4.29 U11.15(D6)
INT46: SV4.30 U11.17(D7)
INT47: SV4.35 U11.19(D8)
INT48: SV7.17 U32.6(D1)
INT49: SV7.18 U32.8(D2)
INT50: SV7.23 U32.10(D3)
INT51: SV7.24 U32.12(D4)
INT52: SV7.29 U32.13(D5)
INT53: SV7.30 U32.15(D6)
INT54: SV7.35 U32.17(D7)
INT55: SV7.36 U32.19(D8)
INT56: SV7.38 U34.6(D1)
INT57: SV8.5 U34.8(D2)
INT58: SV8.6 U34.10(D3)
INT59: SV8.11 U34.12(D4)
INT60: SV8.12 U34.13(D5)
INT61: SV8.17 U34.15(D6)
INT62: SV8.18 U34.17(D7)
INT63: SV8.23 U34.19(D8)
INT64: SV4.36 U18.6(D1)
INT65: SV4.38 U18.8(D2)
INT66: SV5.5 U18.10(D3)
INT67: SV5.6 U18.12(D4)
INT68: SV5.11 U18.13(D5)
INT69: SV5.12 U18.15(D6)
INT70: SV5.17 U18.17(D7)
INT71: SV5.18 U18.19(D8)
INT72: SV5.23 U20.6(D1)
INT73: SV5.24 U20.8(D2)
INT74: SV5.29 U20.10(D3)
INT75: SV5.30 U20.12(D4)
INT76: SV5.35 U20.13(D5)
INT77: SV5.36 U20.15(D6)
INT78: SV5.38 U20.17(D7)
INT79: SV6.5 U20.19(D8)
INT80: SV8.24 U39.6(D1)
INT81: SV8.29 U39.8(D2)
INT82: SV8.30 U39.10(D3)
INT83: SV8.35 U39.12(D4)
INT84: SV8.36 U39.13(D5)
INT85: SV8.38 U39.15(D6)
INT86: SV9.5 U39.17(D7)
INT87: SV9.6 U39.19(D8)
INT88: SV9.11 U41.6(D1)
INT89: SV9.12 U41.8(D2)
INT90: SV9.17 U41.10(D3)
INT91: SV9.18 U41.12(D4)
INT92: SV9.23 U41.13(D5)
INT93: SV9.24 U41.15(D6)
INT94: SV9.29 U41.17(D7)
INT95: SV9.30 U41.19(D8)
INT_H: R163.2 U56.16(B3) U$1.51(P_3.0)
INT_L: R158.2 U54.6(D1) U56.5(A3)
INT_MP0: TP6.TP U4.5(S1) U4.7(S2) U4.9(S3) U4.11(S4) U54.5(S1) U54.7(S2) U58.5(S1)
INT_MP1: TP9.TP U26.5(S1) U26.7(S2) U26.9(S3) U26.11(S4) U54.14(S5) U58.11(S4)
INT_MP2: TP7.TP U8.5(S1) U8.7(S2) U8.9(S3) U8.11(S4) U54.9(S3) U58.7(S2)
INT_MP3: TP10.TP U33.5(S1) U33.7(S2) U33.9(S3) U33.11(S4) U54.16(S6) U58.14(S5)
INT_MP4: TP8.TP U19.5(S1) U19.7(S2) U19.9(S3) U19.11(S4) U54.11(S4) U58.9(S3)
INT_MP5: TP11.TP U40.5(S1) U40.7(S2) U40.9(S3) U40.11(S4) U54.18(S7) U58.16(S6)
N$1: C4.1 R1.1 U1.1(SET)
N$2: C7.1 R2.2 U2.7(SET)
N$3: C1.1 C2.1 U1.3(IN) X2.1 X2.1@1
N$4: R2.1 U3.1(VOUT)
N$5: R165.2 U56.15(B4) U$1.24(P_1.7)
N$6: U54.8(D2) U54.10(D3) U54.12(D4) U54.13(D5) U54.15(D6) U54.17(D7)
N$7: C5.1 JP1.1 JP2.2 R_LDO1.1 U2.1(OUT_2) U2.2(OUT_3) U2.3(OUT_4) U2.4(OUT_5) U2.5(OUT_6) U2.6(OUT_7) U2.8(OUT_8) U2.9(OUT_9) U2.16(OUT) U2.EPAD
N$8: U4.6(D1) U5.5(S1) U5.7(S2) U5.9(S3) U5.11(S4)
N$9: U4.8(D2) U5.14(S5) U5.16(S6) U5.18(S7) U5.20(S8)
N$10: U4.10(D3) U6.5(S1) U6.7(S2) U6.9(S3) U6.11(S4)
N$11: U4.12(D4) U6.14(S5) U6.16(S6) U6.18(S7) U6.20(S8)
N$12: U4.19(D8) U10.14(S5) U10.16(S6) U10.18(S7) U10.20(S8)
N$13: U4.17(D7) U10.5(S1) U10.7(S2) U10.9(S3) U10.11(S4)
N$14: U4.15(D6) U9.14(S5) U9.16(S6) U9.18(S7) U9.20(S8)
N$15: U4.13(D5) U9.5(S1) U9.7(S2) U9.9(S3) U9.11(S4)
N$16: U7.5(S1) U7.7(S2) U7.9(S3) U7.11(S4) U8.6(D1)
N$17: R4.2 U6.22(DOUT) U9.3(DIN)
N$18: C24.2 R164.2 U56.19(VREF_B) U56.20(EN)
N$19: R161.2 U56.18(B1) U$1.11(P_12.5)
N$20: U7.14(S5) U7.16(S6) U7.18(S7) U7.20(S8) U8.8(D2)
N$21: R11.2 U4.22(DOUT) U5.3(DIN)
N$22: R3.2 U5.22(DOUT) U6.3(DIN)
N$23: U8.10(D3) U11.5(S1) U11.7(S2) U11.9(S3) U11.11(S4)
N$24: U8.12(D4) U11.14(S5) U11.16(S6) U11.18(S7) U11.20(S8)
N$25: U8.19(D8) U15.14(S5) U15.16(S6) U15.18(S7) U15.20(S8)
N$26: R7.2 U9.22(DOUT) U10.3(DIN)
N$27: R8.1 U10.22(DOUT)
N$28: U8.17(D7) U15.5(S1) U15.7(S2) U15.9(S3) U15.11(S4)
N$29: R162.2 U56.17(B2) U$1.12(P_12.4)
N$30: U8.15(D6) U12.14(S5) U12.16(S6) U12.18(S7) U12.20(S8)
N$31: U8.13(D5) U12.5(S1) U12.7(S2) U12.9(S3) U12.11(S4)
N$32: R5.2 U7.22(DOUT) U11.3(DIN)
N$33: R6.2 U11.22(DOUT) U12.3(DIN)
N$34: R9.2 U12.22(DOUT) U15.3(DIN)
N$35: R10.2 U7.3(DIN) U8.22(DOUT)
N$37: R166.2 U56.14(B5) U$1.23(P_1.6)
N$38: R44.1 U15.22(DOUT)
N$39: R167.2 U56.13(B6) U$1.22(P_1.5)
N$40: U18.5(S1) U18.7(S2) U18.9(S3) U18.11(S4) U19.6(D1)
N$41: U18.14(S5) U18.16(S6) U18.18(S7) U18.20(S8) U19.8(D2)
N$42: U19.10(D3) U20.5(S1) U20.7(S2) U20.9(S3) U20.11(S4)
N$43: U19.12(D4) U20.14(S5) U20.16(S6) U20.18(S7) U20.20(S8)
N$44: U19.19(D8) U22.14(S5) U22.16(S6) U22.18(S7) U22.20(S8)
N$45: U19.17(D7) U22.5(S1) U22.7(S2) U22.9(S3) U22.11(S4)
N$46: U19.15(D6) U21.14(S5) U21.16(S6) U21.18(S7) U21.20(S8)
N$47: U19.13(D5) U21.5(S1) U21.7(S2) U21.9(S3) U21.11(S4)
N$48: R45.2 U18.22(DOUT) U20.3(DIN)
N$49: R46.2 U20.22(DOUT) U21.3(DIN)
N$50: R47.2 U21.22(DOUT) U22.3(DIN)
N$51: R48.2 U18.3(DIN) U19.22(DOUT)
N$53: R168.2 U56.12(B7) U$1.21(P_1.4)
N$54: R65.1 U22.22(DOUT)
N$55: R169.2 U56.11(B8) U$1.19(P_1.2)
N$56: U25.5(S1) U25.7(S2) U25.9(S3) U25.11(S4) U26.6(D1)
N$57: U25.14(S5) U25.16(S6) U25.18(S7) U25.20(S8) U26.8(D2)
N$58: U26.10(D3) U27.5(S1) U27.7(S2) U27.9(S3) U27.11(S4)
N$59: U26.12(D4) U27.14(S5) U27.16(S6) U27.18(S7) U27.20(S8)
N$60: U26.19(D8) U29.14(S5) U29.16(S6) U29.18(S7) U29.20(S8)
N$61: U26.17(D7) U29.5(S1) U29.7(S2) U29.9(S3) U29.11(S4)
N$62: U26.15(D6) U28.14(S5) U28.16(S6) U28.18(S7) U28.20(S8)
N$63: U26.13(D5) U28.5(S1) U28.7(S2) U28.9(S3) U28.11(S4)
N$64: R66.2 U25.22(DOUT) U27.3(DIN)
N$65: R67.2 U27.22(DOUT) U28.3(DIN)
N$66: R68.2 U28.22(DOUT) U29.3(DIN)
N$67: R69.2 U25.3(DIN) U26.22(DOUT)
N$70: R86.1 U29.22(DOUT)
N$72: U32.5(S1) U32.7(S2) U32.9(S3) U32.11(S4) U33.6(D1)
N$73: U32.14(S5) U32.16(S6) U32.18(S7) U32.20(S8) U33.8(D2)
N$74: U33.10(D3) U34.5(S1) U34.7(S2) U34.9(S3) U34.11(S4)
N$75: U33.12(D4) U34.14(S5) U34.16(S6) U34.18(S7) U34.20(S8)
N$76: U33.19(D8) U36.14(S5) U36.16(S6) U36.18(S7) U36.20(S8)
N$77: U33.17(D7) U36.5(S1) U36.7(S2) U36.9(S3) U36.11(S4)
N$78: U33.15(D6) U35.14(S5) U35.16(S6) U35.18(S7) U35.20(S8)
N$79: U33.13(D5) U35.5(S1) U35.7(S2) U35.9(S3) U35.11(S4)
N$80: R87.2 U32.22(DOUT) U34.3(DIN)
N$81: R88.2 U34.22(DOUT) U35.3(DIN)
N$82: R89.2 U35.22(DOUT) U36.3(DIN)
N$83: R90.2 U32.3(DIN) U33.22(DOUT)
N$84: SCK.TP U4.1(SCLK) U5.1(SCLK) U6.1(SCLK) U7.1(SCLK) U8.1(SCLK) U9.1(SCLK) U10.1(SCLK) U11.1(SCLK) U12.1(SCLK) U15.1(SCLK) U18.1(SCLK) U19.1(SCLK) U20.1(SCLK) U21.1(SCLK) U22.1(SCLK) U25.1(SCLK) U26.1(SCLK) U27.1(SCLK) U28.1(SCLK) U29.1(SCLK) U32.1(SCLK) U33.1(SCLK) U34.1(SCLK) U35.1(SCLK) U36.1(SCLK) U39.1(SCLK) U40.1(SCLK) U41.1(SCLK) U42.1(SCLK) U43.1(SCLK) U$1.47(P_3.4)
N$86: R107.1 U36.22(DOUT)
N$87: R131.2 U58.6(D1) U58.8(D2) U58.10(D3) U58.12(D4) U58.13(D5) U58.15(D6)
N$88: U39.5(S1) U39.7(S2) U39.9(S3) U39.11(S4) U40.6(D1)
N$89: U39.14(S5) U39.16(S6) U39.18(S7) U39.20(S8) U40.8(D2)
N$90: U40.10(D3) U41.5(S1) U41.7(S2) U41.9(S3) U41.11(S4)
N$91: U40.12(D4) U41.14(S5) U41.16(S6) U41.18(S7) U41.20(S8)
N$92: U40.19(D8) U43.14(S5) U43.16(S6) U43.18(S7) U43.20(S8)
N$93: U40.17(D7) U43.5(S1) U43.7(S2) U43.9(S3) U43.11(S4)
N$94: U40.15(D6) U42.14(S5) U42.16(S6) U42.18(S7) U42.20(S8)
N$95: U40.13(D5) U42.5(S1) U42.7(S2) U42.9(S3) U42.11(S4)
N$96: R108.2 U39.22(DOUT) U41.3(DIN)
N$97: R109.2 U41.22(DOUT) U42.3(DIN)
N$98: R110.2 U42.22(DOUT) U43.3(DIN)
N$99: R111.2 U39.3(DIN) U40.22(DOUT)
N$102: R128.1 U43.22(DOUT)
N$195: MOSI.TP U4.3(DIN) U8.3(DIN) U19.3(DIN) U26.3(DIN) U33.3(DIN) U40.3(DIN) U$1.48(P_3.3)
SCL: R133.2 TP21.TP U13.2(1D0) U13.4(1D1) U13.6(1D2) U13.8(1D3) U13.11(2D3) U13.13(2D2) U13.15(2D1) U13.17(2D0) U14.2(1D0) U14.4(1D1) U14.6(1D2) U14.8(1D3) U14.11(2D3) U14.13(2D2) U14.15(2D1) U14.17(2D0) U16.2(1D0) U16.4(1D1) U16.6(1D2) U16.8(1D3) U16.11(2D3) U16.13(2D2) U16.15(2D1) U16.17(2D0) U17.2(1D0) U17.4(1D1) U17.6(1D2) U17.8(1D3) U17.11(2D3) U17.13(2D2) U17.15(2D1) U17.17(2D0) U23.2(1D0) U23.4(1D1) U23.6(1D2) U23.8(1D3) U23.11(2D3) U23.13(2D2) U23.15(2D1) U23.17(2D0) U24.2(1D0) U24.4(1D1) U24.6(1D2) U24.8(1D3) U24.11(2D3) U24.13(2D2) U24.15(2D1) U24.17(2D0) U30.2(1D0) U30.4(1D1) U30.6(1D2) U30.8(1D3) U30.11(2D3) U30.13(2D2) U30.15(2D1) U30.17(2D0) U31.2(1D0) U31.4(1D1) U31.6(1D2) U31.8(1D3) U31.11(2D3) U31.13(2D2) U31.15(2D1) U31.17(2D0) U37.2(1D0) U37.4(1D1) U37.6(1D2) U37.8(1D3) U37.11(2D3) U37.13(2D2) U37.15(2D1) U37.17(2D0) U38.2(1D0) U38.4(1D1) U38.6(1D2) U38.8(1D3) U38.11(2D3) U38.13(2D2) U38.15(2D1) U38.17(2D0) U44.2(1D0) U44.4(1D1) U44.6(1D2) U44.8(1D3) U44.11(2D3) U44.13(2D2) U44.15(2D1) U44.17(2D0) U45.2(1D0) U45.4(1D1) U45.6(1D2) U45.8(1D3) U45.11(2D3) U45.13(2D2) U45.15(2D1) U45.17(2D0) U47.7(SCLB)
SCL0: SV2.17 U13.18(!1O0)
SCL1: SV2.18 U13.16(!1O1)
SCL2: SV2.23 U13.14(!1O2)
SCL3: SV2.24 U13.12(!1O3)
SCL4: SV2.29 U13.3(!2O0)
SCL5: SV2.30 U13.5(!2O1)
SCL6: SV2.35 U13.7(!2O2)
SCL7: SV2.36 U13.9(!2O3)
SCL8: SV3.1 U14.18(!1O0)
SCL9: SV3.2 U14.16(!1O1)
SCL10: SV3.7 U14.14(!1O2)
SCL11: SV3.8 U14.12(!1O3)
SCL12: SV3.13 U14.3(!2O0)
SCL13: SV3.14 U14.5(!2O1)
SCL14: SV3.19 U14.7(!2O2)
SCL15: SV3.20 U14.9(!2O3)
SCL16: SV6.2 U30.18(!1O0)
SCL17: SV6.7 U30.16(!1O1)
SCL18: SV6.8 U30.14(!1O2)
SCL19: SV6.13 U30.12(!1O3)
SCL20: SV6.14 U30.3(!2O0)
SCL21: SV6.19 U30.5(!2O1)
SCL22: SV6.20 U30.7(!2O2)
SCL23: SV6.25 U30.9(!2O3)
SCL24: SV6.26 U31.18(!1O0)
SCL25: SV6.31 U31.16(!1O1)
SCL26: SV6.32 U31.14(!1O2)
SCL27: SV6.37 U31.12(!1O3)
SCL28: SV7.1 U31.3(!2O0)
SCL29: SV7.2 U31.5(!2O1)
SCL30: SV7.7 U31.7(!2O2)
SCL31: SV7.8 U31.9(!2O3)
SCL32: SV3.25 U16.18(!1O0)
SCL33: SV3.26 U16.16(!1O1)
SCL34: SV3.31 U16.14(!1O2)
SCL35: SV3.32 U16.12(!1O3)
SCL36: SV3.37 U16.3(!2O0)
SCL37: SV4.1 U16.5(!2O1)
SCL38: SV4.2 U16.7(!2O2)
SCL39: SV4.7 U16.9(!2O3)
SCL40: SV4.8 U17.18(!1O0)
SCL41: SV4.13 U17.16(!1O1)
SCL42: SV4.14 U17.14(!1O2)
SCL43: SV4.19 U17.12(!1O3)
SCL44: SV4.20 U17.3(!2O0)
SCL45: SV4.25 U17.5(!2O1)
SCL46: SV4.26 U17.7(!2O2)
SCL47: SV4.31 U17.9(!2O3)
SCL48: SV7.13 U37.18(!1O0)
SCL49: SV7.14 U37.16(!1O1)
SCL50: SV7.19 U37.14(!1O2)
SCL51: SV7.20 U37.12(!1O3)
SCL52: SV7.25 U37.3(!2O0)
SCL53: SV7.26 U37.5(!2O1)
SCL54: SV7.31 U37.7(!2O2)
SCL55: SV7.32 U37.9(!2O3)
SCL56: SV7.37 U38.18(!1O0)
SCL57: SV8.1 U38.16(!1O1)
SCL58: SV8.2 U38.14(!1O2)
SCL59: SV8.7 U38.12(!1O3)
SCL60: SV8.8 U38.3(!2O0)
SCL61: SV8.13 U38.5(!2O1)
SCL62: SV8.14 U38.7(!2O2)
SCL63: SV8.19 U38.9(!2O3)
SCL64: SV4.32 U23.18(!1O0)
SCL65: SV4.37 U23.16(!1O1)
SCL66: SV5.1 U23.14(!1O2)
SCL67: SV5.2 U23.12(!1O3)
SCL68: SV5.7 U23.3(!2O0)
SCL69: SV5.8 U23.5(!2O1)
SCL70: SV5.13 U23.7(!2O2)
SCL71: SV5.14 U23.9(!2O3)
SCL72: SV5.19 U24.18(!1O0)
SCL73: SV5.20 U24.16(!1O1)
SCL74: SV5.25 U24.14(!1O2)
SCL75: SV5.26 U24.12(!1O3)
SCL76: SV5.31 U24.3(!2O0)
SCL77: SV5.32 U24.5(!2O1)
SCL78: SV5.37 U24.7(!2O2)
SCL79: SV6.1 U24.9(!2O3)
SCL80: SV8.20 U44.18(!1O0)
SCL81: SV8.25 U44.16(!1O1)
SCL82: SV8.26 U44.14(!1O2)
SCL83: SV8.31 U44.12(!1O3)
SCL84: SV8.32 U44.3(!2O0)
SCL85: SV8.37 U44.5(!2O1)
SCL86: SV9.1 U44.7(!2O2)
SCL87: SV9.2 U44.9(!2O3)
SCL88: SV9.7 U45.18(!1O0)
SCL89: SV9.8 U45.16(!1O1)
SCL90: SV9.13 U45.14(!1O2)
SCL91: SV9.14 U45.12(!1O3)
SCL92: SV9.19 U45.3(!2O0)
SCL93: SV9.20 U45.5(!2O1)
SCL94: SV9.25 U45.7(!2O2)
SCL95: SV9.26 U45.9(!2O3)
SCL_A: R159.2 TP23.TP U47.2(SCLA) U56.4(A2)
SCL_H: R156.2 TP2.TP U3.5(SCL) U54.1(SCL) U58.1(SCL) U$1.14(P_12.2)
SDA0: R19.2 SV2.19 U9.6(D1)
SDA1: R18.2 SV2.20 U9.8(D2)
SDA2: R17.2 SV2.25 U9.10(D3)
SDA3: R16.2 SV2.26 U9.12(D4)
SDA4: R15.2 SV2.31 U9.13(D5)
SDA5: R14.2 SV2.32 U9.15(D6)
SDA6: R13.2 SV2.37 U9.17(D7)
SDA7: R12.2 SV2.38 U9.19(D8)
SDA8: R27.2 SV3.3 U10.6(D1)
SDA9: R26.2 SV3.4 U10.8(D2)
SDA10: R25.2 SV3.9 U10.10(D3)
SDA11: R24.2 SV3.10 U10.12(D4)
SDA12: R23.2 SV3.15 U10.13(D5)
SDA13: R22.2 SV3.16 U10.15(D6)
SDA14: R21.2 SV3.21 U10.17(D7)
SDA15: R20.2 SV3.22 U10.19(D8)
SDA16: R77.2 SV6.4 U28.6(D1)
SDA17: R76.2 SV6.9 U28.8(D2)
SDA18: R75.2 SV6.10 U28.10(D3)
SDA19: R74.2 SV6.15 U28.12(D4)
SDA20: R73.2 SV6.16 U28.13(D5)
SDA21: R72.2 SV6.21 U28.15(D6)
SDA22: R71.2 SV6.22 U28.17(D7)
SDA23: R70.2 SV6.27 U28.19(D8)
SDA24: R85.2 SV6.28 U29.6(D1)
SDA25: R84.2 SV6.33 U29.8(D2)
SDA26: R83.2 SV6.34 U29.10(D3)
SDA27: R82.2 SV6.39 U29.12(D4)
SDA28: R81.2 SV7.3 U29.13(D5)
SDA29: R80.2 SV7.4 U29.15(D6)
SDA30: R79.2 SV7.9 U29.17(D7)
SDA31: R78.2 SV7.10 U29.19(D8)
SDA32: R35.2 SV3.27 U12.6(D1)
SDA33: R34.2 SV3.28 U12.8(D2)
SDA34: R33.2 SV3.33 U12.10(D3)
SDA35: R32.2 SV3.34 U12.12(D4)
SDA36: R31.2 SV3.39 U12.13(D5)
SDA37: R30.2 SV4.3 U12.15(D6)
SDA38: R29.2 SV4.4 U12.17(D7)
SDA39: R28.2 SV4.9 U12.19(D8)
SDA40: R43.2 SV4.10 U15.6(D1)
SDA41: R42.2 SV4.15 U15.8(D2)
SDA42: R41.2 SV4.16 U15.10(D3)
SDA43: R40.2 SV4.21 U15.12(D4)
SDA44: R39.2 SV4.22 U15.13(D5)
SDA45: R38.2 SV4.27 U15.15(D6)
SDA46: R37.2 SV4.28 U15.17(D7)
SDA47: R36.2 SV4.33 U15.19(D8)
SDA48: R98.2 SV7.15 U35.6(D1)
SDA49: R97.2 SV7.16 U35.8(D2)
SDA50: R96.2 SV7.21 U35.10(D3)
SDA51: R95.2 SV7.22 U35.12(D4)
SDA52: R94.2 SV7.27 U35.13(D5)
SDA53: R93.2 SV7.28 U35.15(D6)
SDA54: R92.2 SV7.33 U35.17(D7)
SDA55: R91.2 SV7.34 U35.19(D8)
SDA56: R106.2 SV7.39 U36.6(D1)
SDA57: R105.2 SV8.3 U36.8(D2)
SDA58: R104.2 SV8.4 U36.10(D3)
SDA59: R103.2 SV8.9 U36.12(D4)
SDA60: R102.2 SV8.10 U36.13(D5)
SDA61: R101.2 SV8.15 U36.15(D6)
SDA62: R100.2 SV8.16 U36.17(D7)
SDA63: R99.2 SV8.21 U36.19(D8)
SDA64: R56.2 SV4.34 U21.6(D1)
SDA65: R55.2 SV4.39 U21.8(D2)
SDA66: R54.2 SV5.3 U21.10(D3)
SDA67: R53.2 SV5.4 U21.12(D4)
SDA68: R52.2 SV5.9 U21.13(D5)
SDA69: R51.2 SV5.10 U21.15(D6)
SDA70: R50.2 SV5.15 U21.17(D7)
SDA71: R49.2 SV5.16 U21.19(D8)
SDA72: R64.2 SV5.21 U22.6(D1)
SDA73: R63.2 SV5.22 U22.8(D2)
SDA74: R62.2 SV5.27 U22.10(D3)
SDA75: R61.2 SV5.28 U22.12(D4)
SDA76: R60.2 SV5.33 U22.13(D5)
SDA77: R59.2 SV5.34 U22.15(D6)
SDA78: R58.2 SV5.39 U22.17(D7)
SDA79: R57.2 SV6.3 U22.19(D8)
SDA80: R119.2 SV8.22 U42.6(D1)
SDA81: R118.2 SV8.27 U42.8(D2)
SDA82: R117.2 SV8.28 U42.10(D3)
SDA83: R116.2 SV8.33 U42.12(D4)
SDA84: R115.2 SV8.34 U42.13(D5)
SDA85: R114.2 SV8.39 U42.15(D6)
SDA86: R113.2 SV9.3 U42.17(D7)
SDA87: R112.2 SV9.4 U42.19(D8)
SDA88: R127.2 SV9.9 U43.6(D1)
SDA89: R126.2 SV9.10 U43.8(D2)
SDA90: R125.2 SV9.15 U43.10(D3)
SDA91: R124.2 SV9.16 U43.12(D4)
SDA92: R123.2 SV9.21 U43.13(D5)
SDA93: R122.2 SV9.22 U43.15(D6)
SDA94: R121.2 SV9.27 U43.17(D7)
SDA95: R120.2 SV9.28 U43.19(D8)
SDA_H: R154.2 TP1.TP U3.4(SDA) U54.3(SDA) U58.3(SDA) U$1.50(P_3.1)
SDA_MP0: R160.2 TP16.TP U46.3(SDAA) U56.3(A1)
SDA_MP0B: R137.2 TP22.TP U4.14(S5) U4.16(S6) U4.18(S7) U4.20(S8) U46.6(SDAB)
SDA_MP1: R172.2 TP14.TP U46.2(SCLA) U56.8(A6)
SDA_MP1B: R136.2 U26.14(S5) U26.16(S6) U26.18(S7) U26.20(S8) U46.7(SCLB)
SDA_MP2: R170.2 TP17.TP U48.3(SDAA) U56.6(A4)
SDA_MP2B: R141.2 TP25.TP U8.14(S5) U8.16(S6) U8.18(S7) U8.20(S8) U48.6(SDAB)
SDA_MP3: R173.2 TP13.TP U48.2(SCLA) U56.9(A7)
SDA_MP3B: R139.2 U33.14(S5) U33.16(S6) U33.18(S7) U33.20(S8) U48.7(SCLB)
SDA_MP4: R171.2 TP15.TP U49.3(SDAA) U56.7(A5)
SDA_MP4B: R145.2 TP27.TP U19.14(S5) U19.16(S6) U19.18(S7) U19.20(S8) U49.6(SDAB)
SDA_MP5: R174.2 TP12.TP U49.2(SCLA) U56.10(A8)
SDA_MP5B: R144.2 U40.14(S5) U40.16(S6) U40.18(S7) U40.20(S8) U49.7(SCLB)
SYNC: SYNC.TP U4.24(SYNC_N) U5.24(SYNC_N) U6.24(SYNC_N) U7.24(SYNC_N) U8.24(SYNC_N) U9.24(SYNC_N) U10.24(SYNC_N) U11.24(SYNC_N) U12.24(SYNC_N) U15.24(SYNC_N) U18.24(SYNC_N) U19.24(SYNC_N) U20.24(SYNC_N) U21.24(SYNC_N) U22.24(SYNC_N) U25.24(SYNC_N) U26.24(SYNC_N) U27.24(SYNC_N) U28.24(SYNC_N) U29.24(SYNC_N) U32.24(SYNC_N) U33.24(SYNC_N) U34.24(SYNC_N) U35.24(SYNC_N) U36.24(SYNC_N) U39.24(SYNC_N) U40.24(SYNC_N) U41.24(SYNC_N) U42.24(SYNC_N) U43.24(SYNC_N) U$1.13(P_12.3)
VDD: C6.1 C8.1 C9.1 C10.1 C11.1 C12.1 C13.1 C14.1 C15.1 C16.1 C17.1 C26.1 C29.1 C30.1 C35.1 C36.1 C41.1 C42.1 C47.1 C48.1 C53.1 C54.1 JP1.2 R12.1 R13.1 R14.1 R15.1 R16.1 R17.1 R18.1 R19.1 R20.1 R21.1 R22.1 R23.1 R24.1 R25.1 R26.1 R27.1 R28.1 R29.1 R30.1 R31.1 R32.1 R33.1 R34.1 R35.1 R36.1 R37.1 R38.1 R39.1 R40.1 R41.1 R42.1 R43.1 R49.1 R50.1 R51.1 R52.1 R53.1 R54.1 R55.1 R56.1 R57.1 R58.1 R59.1 R60.1 R61.1 R62.1 R63.1 R64.1 R70.1 R71.1 R72.1 R73.1 R74.1 R75.1 R76.1 R77.1 R78.1 R79.1 R80.1 R81.1 R82.1 R83.1 R84.1 R85.1 R91.1 R92.1 R93.1 R94.1 R95.1 R96.1 R97.1 R98.1 R99.1 R100.1 R101.1 R102.1 R103.1 R104.1 R105.1 R106.1 R112.1 R113.1 R114.1 R115.1 R116.1 R117.1 R118.1 R119.1 R120.1 R121.1 R122.1 R123.1 R124.1 R125.1 R126.1 R127.1 R133.1 R136.1 R137.1 R139.1 R141.1 R144.1 R145.1 R158.1 R159.1 R160.1 R170.1 R171.1 R172.1 R173.1 R174.1 SV2.7 SV2.8 SV2.9 SV2.10 U13.20(VCC) U14.20(VCC) U16.20(VCC) U17.20(VCC) U23.20(VCC) U24.20(VCC) U30.20(VCC) U31.20(VCC) U37.20(VCC) U38.20(VCC) U44.20(VCC) U45.20(VCC) U46.1(VCCA) U46.5(EN) U46.8(VCCB) U47.1(VCCA) U47.5(EN) U47.8(VCCB) U48.1(VCCA) U48.5(EN) U48.8(VCCB) U49.1(VCCA) U49.5(EN) U49.8(VCCB) U56.2(VREF_A) VDD.TP X3.1 X3.1@1
Unconnected: U47.3(SDAA) U47.6(SDAB) U54.19(D8) U54.20(S8) U58.17(D7) U58.18(S7) U58.19(D8) U58.20(S8) U$1.1(P_2.0) U$1.2(P_2.1) U$1.3(P_2.2) U$1.4(P_2.3) U$1.5(P_2.4) U$1.6(P_2.5) U$1.7(P_2.6) U$1.8(P_2.7) U$1.9(P_12.7) U$1.10(P_12.6) U$1.15(P_12.1) U$1.16(P_12.0) U$1.17(P_1.0) U$1.18(P_1.1) U$1.20(P_1.3) U$1.29(RST1) U$1.30(P_0.7) U$1.31(P_0.6) U$1.32(P_0.5) U$1.33(P_0.4) U$1.34(P_0.3) U$1.35(P_0.2) U$1.36(P_0.1) U$1.37(P_0.0) U$1.38(P_15.5) U$1.39(P_15.4) U$1.40(P_15.3) U$1.41(P_15.2) U$1.42(P_15.1) U$1.43(P_15.0) U$1.44(P_3.7) U$1.45(P_3.6) U$1.46(P_3.5) U$1.49(P_3.2) U$1.67(VTARG2) U$1.68(GND7) U$1.69(RST3) U$1.70(SWDCLK2) U$1.71(SWDIO2)

## Library data of the parts
5V MOSI SCK SYNC TP1 TP2 TP6-TP17 TP21-TP23 TP25 TP27 VDD = testpad:TP: Test pad
C1-C21 C24-C67 = rcl:C-EU: CAPACITOR, European symbol; SPICEPREFIX: C
JP1 JP2 = jumper:JP1E: JUMPER
R1-R128 R131 R133 R136 R137 R139 R141 R144 R145 R154 R156 R158-R174 R_LDO1 R_LDO2 = rcl:R-EU_: RESISTOR, European symbol; SPICEPREFIX: R
SV1 = con-lstb:MA04-1: PIN HEADER; OC_FARNELL: unknown; OC_NEWARK: unknown
SV2-SV9 = con-lstb:MA20-2: PIN HEADER; OC_FARNELL: unknown; OC_NEWARK: unknown
U1 = LT3082:LT3082ESTPBF; BUILT_BY: EMA_UL_Team; MANUFACTURER_PART_NUMBER: LT3082EST#PBF; SOURCELIBRARY: LinearTech_2016-05-13_4; VENDOR: Linear Technology
U2 = LT3083:LT3083EFEPBF; BUILT_BY: EMA_UL_Team; MANUFACTURER_PART_NUMBER: LT3083EFE#PBF; SOURCELIBRARY: LinearTech_2016-05-13_4; VENDOR: Linear Technology
U3 = DAC7571:DAC7571IDBVR; DATASHEET_URL: http://www.ti.com/lit/gpn/DAC7571; DESCRIPTION: Low-Power Rail-To-Rail Output 12-Bit I2C Input DAC; FAMILY_NAME: PRECISION DAC (=<10MSPS); GENERIC_PART_NUMBER: DAC7571; INDUSTRY_STD_PKG_TYPE: SOT-23; MANUFACTURER: Texas Instruments; MANUFACTURER_PART_NUMBER: DAC7571IDBVR; PACKAGE_DESIGNATOR: DBV; PIN_COUNT: 6; VENDOR: Texas Instruments
U4-U12 U15 U18-U22 U25-U29 U32-U36 U39-U43 = ADG714:ADG714BRUZ; BUILT_BY: EMA_UL_Team; MANUFACTURER_PART_NUMBER: ADG714BRUZ; SOURCELIBRARY: Analog_2012-01-01_7; VENDOR: Analog Devices Inc
U13 U14 U16 U17 U23 U24 U30 U31 U37 U38 U44 U45 = MC74LCX240:MC74LCX240DTR2G; COPYRIGHT: Copyright (C) 2016 Accelerated Designs. All rights reserved; MANUFACTURER_PART_NUMBER: MC74LCX240DTR2G; SOURCELIBRARY: ONSemi_2017-12-12_5; VENDOR: ON Semiconductor
U46-U49 = TCA9509:TCA9509DGKR; DATASHEET_URL: http://www.ti.com/lit/gpn/TCA9509; DESCRIPTION: Level Translating I2C Bus Repeater; FAMILY_NAME: I2C HUB, BUFFER, REPEATER; GENERIC_PART_NUMBER: TCA9509; INDUSTRY_STD_PKG_TYPE: MSOP; MANUFACTURER: Texas Instruments; MANUFACTURER_PART_NUMBER: TCA9509DGKR; PACKAGE_DESIGNATOR: DGK; PIN_COUNT: 8; VENDOR: Texas Instruments
U54 U58 = ADG715:ADG715BRUZ; BUILT_BY: EMA_UL_Team; MANUFACTURER_PART_NUMBER: ADG715BRUZ; SOURCELIBRARY: Analog_2012-01-01_7; VENDOR: Analog Devices Inc
U56 = LSF0108:LSF0108RKSR; BUILT_BY: EMA_UL_Team; MANUFACTURER_PART_NUMBER: LSF0108RKSR; SOURCELIBRARY: TI_2016-08-12; VENDOR: Texas Instruments
U$1 = CY8KIT-059:CY8CKIT-059_TARGET: CY8CKIT-059 Target This device exposes the pins of the target section of the CY8CKIT-059, including the programming section, that must be connected to the KitProg in order to program the target micro-controller.
X2-X6 = con-hirschmann:MPB2M: LAB CONNECTOR testpoint; OC_FARNELL: unknown; OC_NEWARK: unknown